# EAGLE design power_supply_module (EAGLE 6.5.0)
AUTHOR: N. Jackson; REV: A; TITLE: Power Supply Module

## Sheet 1 of 9
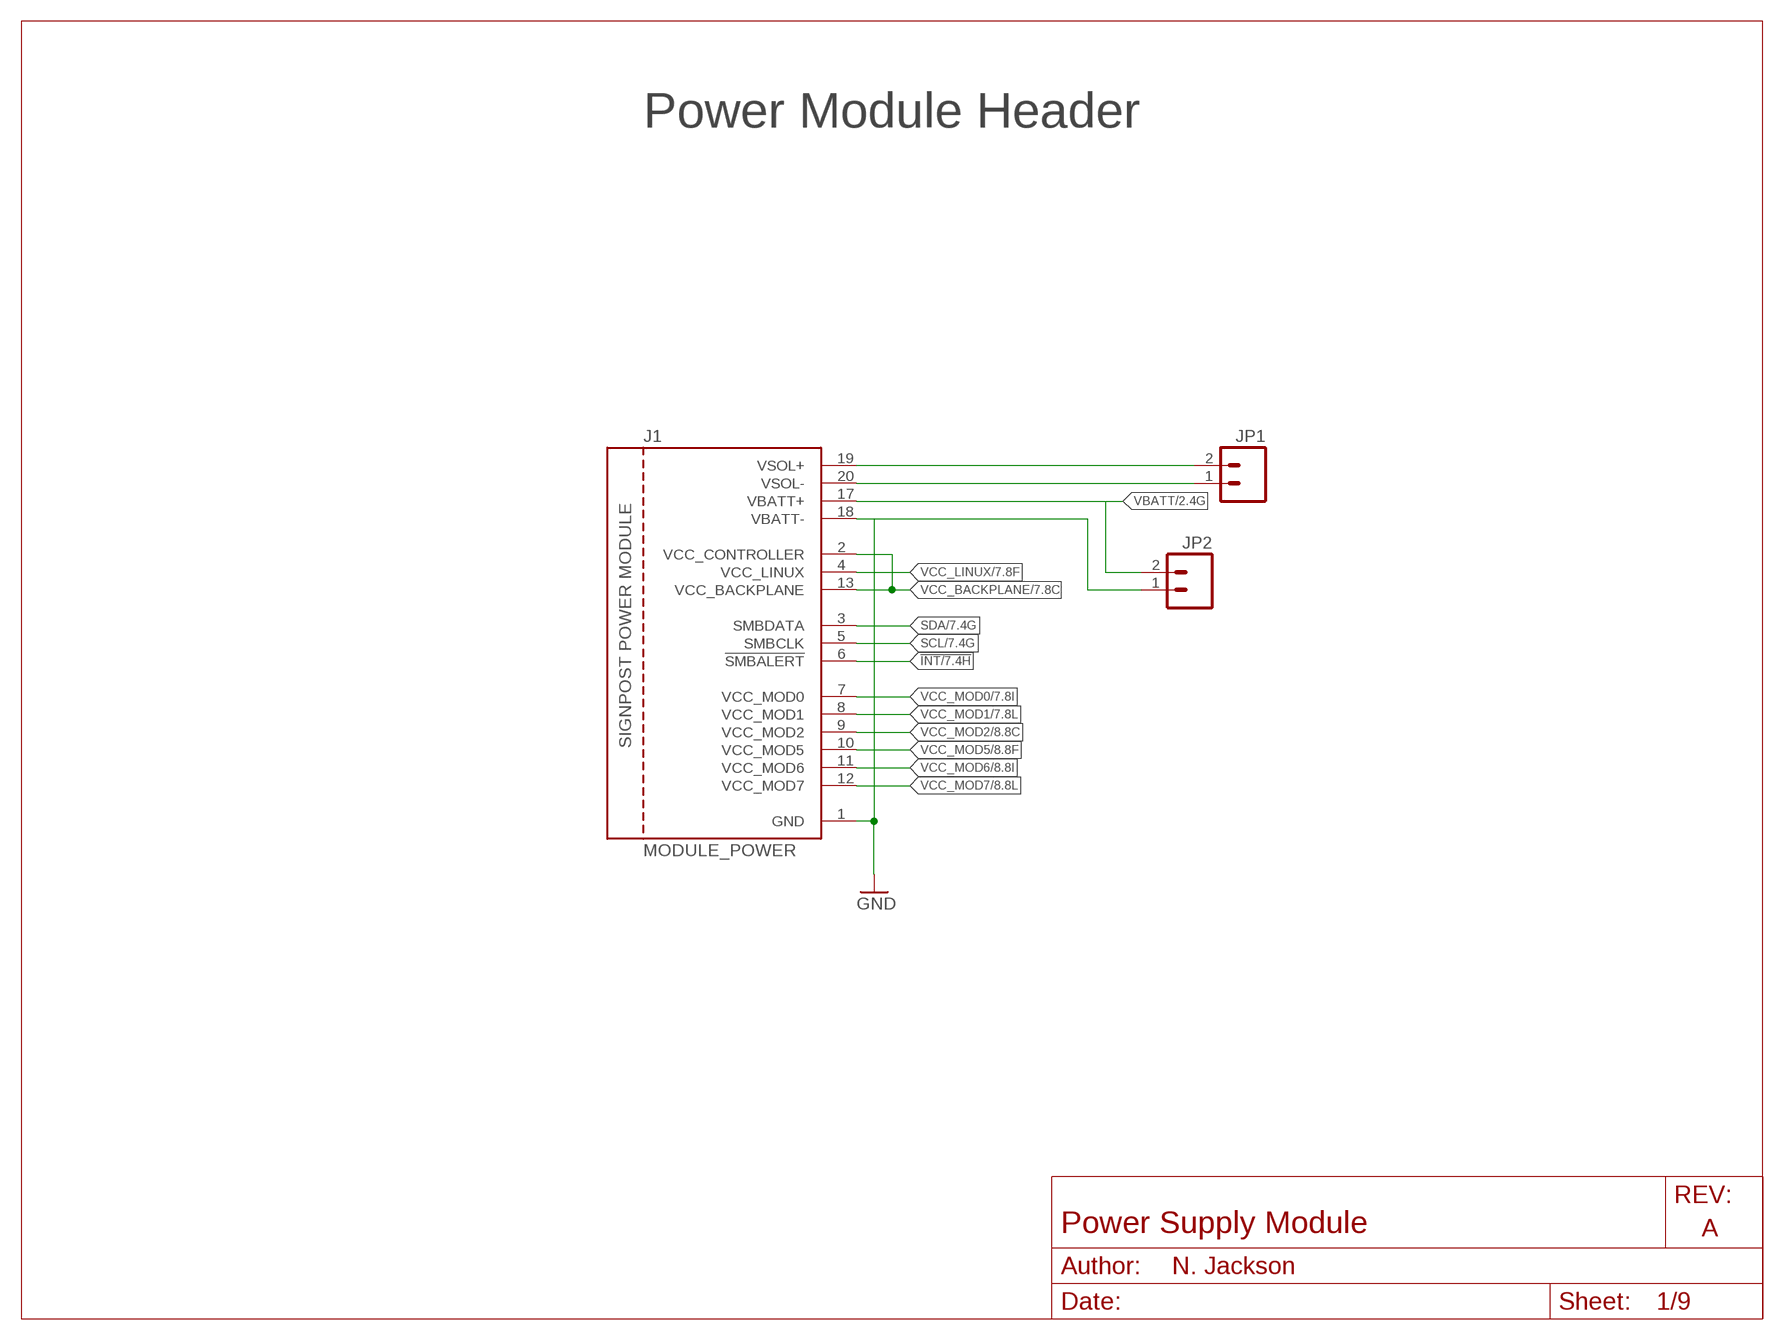
[diagram p0: schematic, sheet 1]

### Parts
J1  MODULE_POWER  [MODULE_POWER]
JP1  M02PTH  [1X02]
JP2  M02PTH  [1X02]

### Nets
!INT: J1.6(!SMBALERT) ; also sheet 7,8,9
GND: J1.1(GND) J1.18(VBATT-) JP2.1 ; also sheet 2,3,4,5,6,7,8,9
SCL: J1.5(SMBCLK) ; also sheet 7,8,9
SDA: J1.3(SMBDATA) ; also sheet 7,8,9
VBATT: J1.17(VBATT+) JP2.2 ; also sheet 2,3,4,5,6,9
VCC_BACKPLANE: J1.2(VCC_CONTROLLER) J1.13(VCC_BACKPLANE) ; also sheet 7,8,9
VCC_LINUX: J1.4(VCC_LINUX) ; also sheet 7,9
VCC_MOD0: J1.7(VCC_MOD0) ; also sheet 7,9
VCC_MOD1: J1.8(VCC_MOD1) ; also sheet 7,9
VCC_MOD2: J1.9(VCC_MOD2) ; also sheet 8,9
VCC_MOD5: J1.10(VCC_MOD5) ; also sheet 8,9
VCC_MOD6: J1.11(VCC_MOD6) ; also sheet 8,9
VCC_MOD7: J1.12(VCC_MOD7) ; also sheet 8,9
VSOL+: J1.19(VSOL+) JP1.2 ; also sheet 9
VSOL-: J1.20(VSOL-) JP1.1 ; also sheet 9

### Notes on the sheet
- Power Module Header

## Sheet 2 of 9
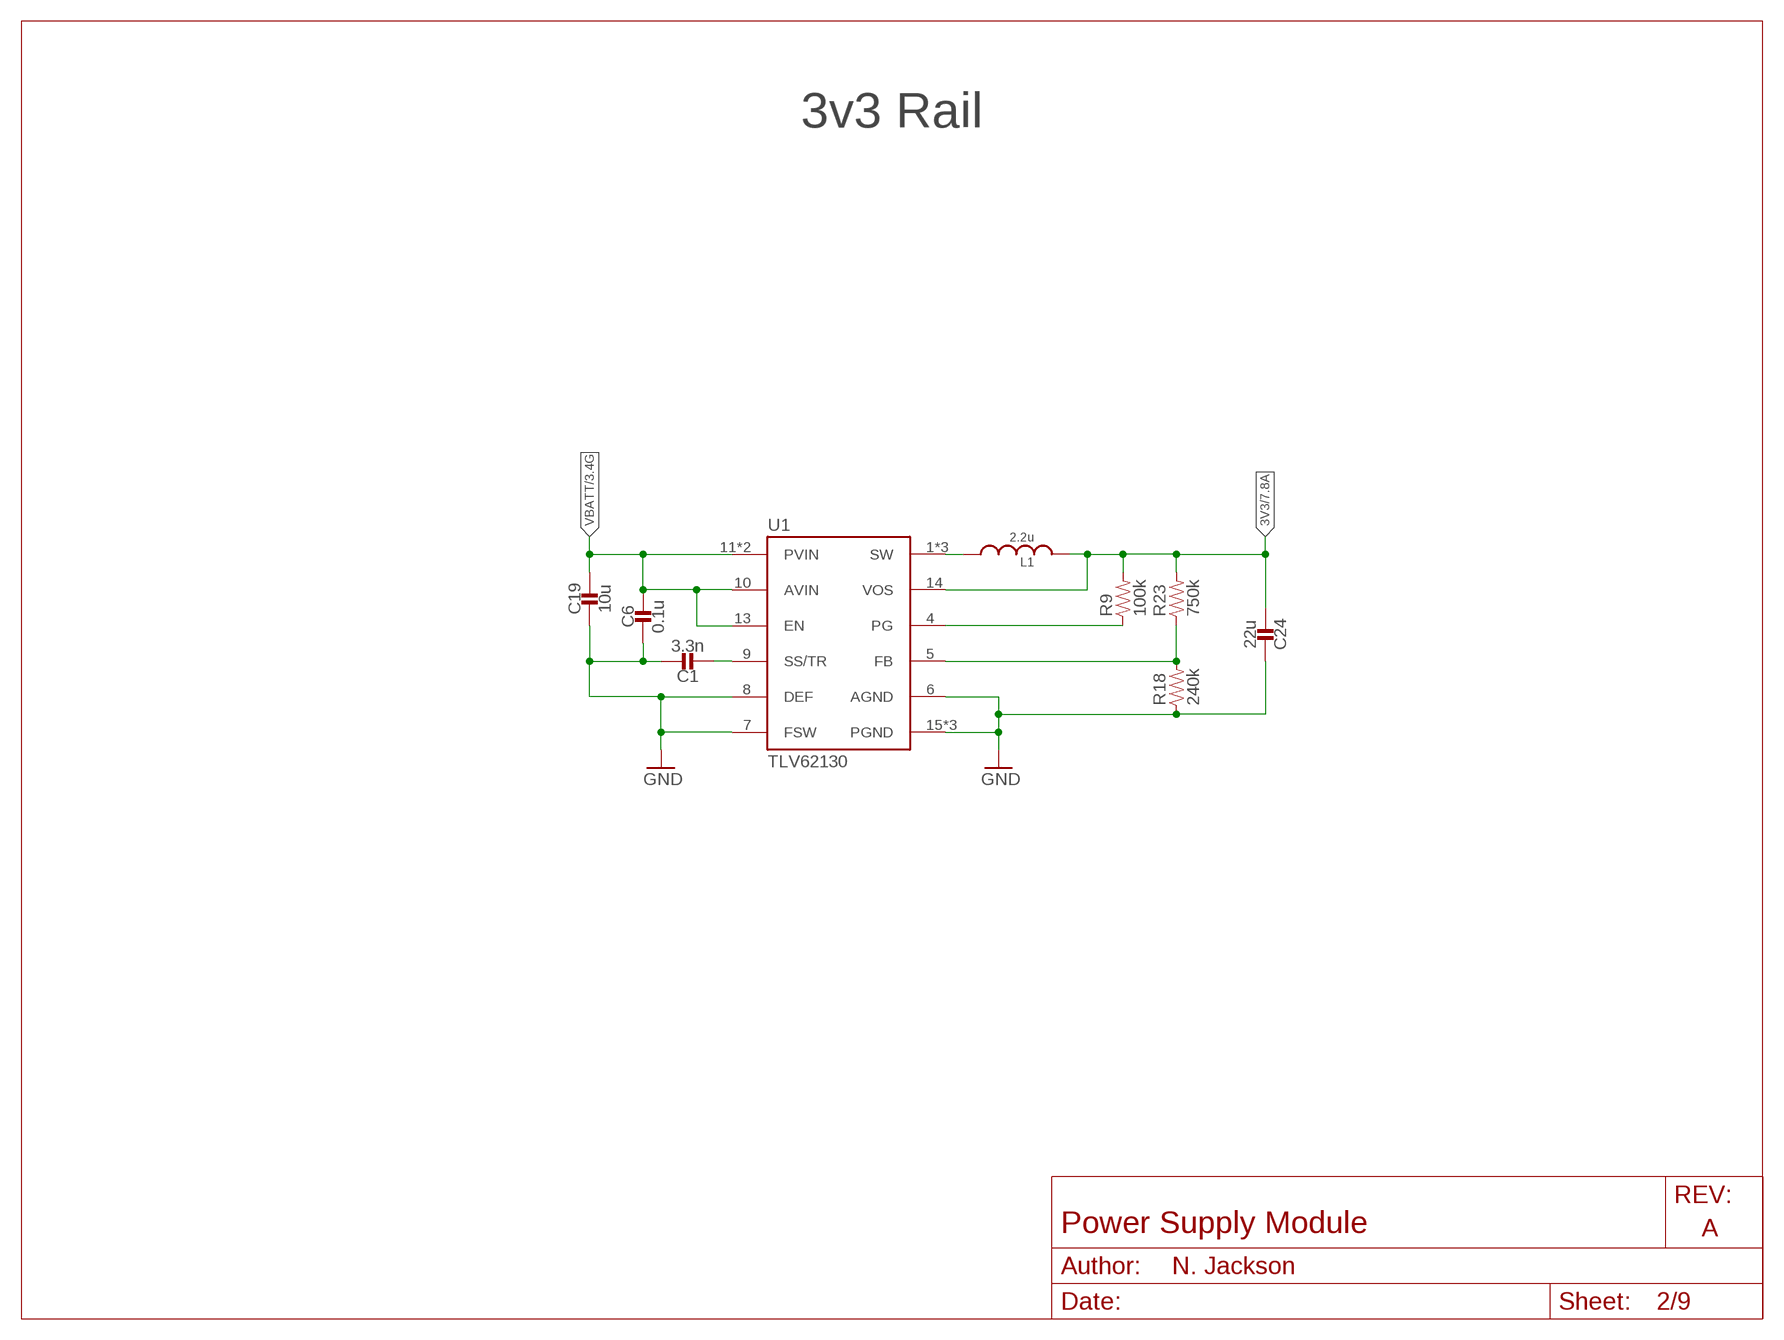
[diagram p1: schematic, sheet 2]

### Parts
C1  3.3n  CAPACITOR0402_CAP  [0402_CAP]
C6  0.1u  CAPACITOR0402_CAP  [0402_CAP]
C19  10u  CAPACITOR0805_CAP  [0805_CAP]
C24  22u  CAPACITOR0603_CAP  [0603_CAP]
L1  2.2u  INDUCTORIHL  [IHL-1212BZ-11]
R9  100k  RESISTOR0402_RES  [0402_RES]
R18  240k  RESISTOR0402_RES  [0402_RES]
R23  750k  RESISTOR0402_RES  [0402_RES]
U1  TLV62130  [TQFN-16/3MM]

### Nets
3V3: C24.2 L1.P$2 R9.2 R23.2 U1.14(VOS) ; also sheet 7,9
GND: C1.1 C6.2 C19.P$2 C24.1 R18.1 U1.6(AGND) U1.7(FSW) U1.8(DEF) U1.15(PGND) U1.16(PGND) U1.GND ; also sheet 1,3,4,5,6,7,8,9
N$61: C1.2 U1.9(SS/TR)
N$62: L1.P$1 U1.1(SW) U1.2(SW) U1.3(SW)
N$63: R9.1 U1.4(PG)
N$64: R18.2 R23.1 U1.5(FB)
VBATT: C6.1 C19.P$1 U1.10(AVIN) U1.11(PVIN) U1.12(PVIN) U1.13(EN) ; also sheet 1,3,4,5,6,9

### Notes on the sheet
- 3v3 Rail

## Sheet 3 of 9
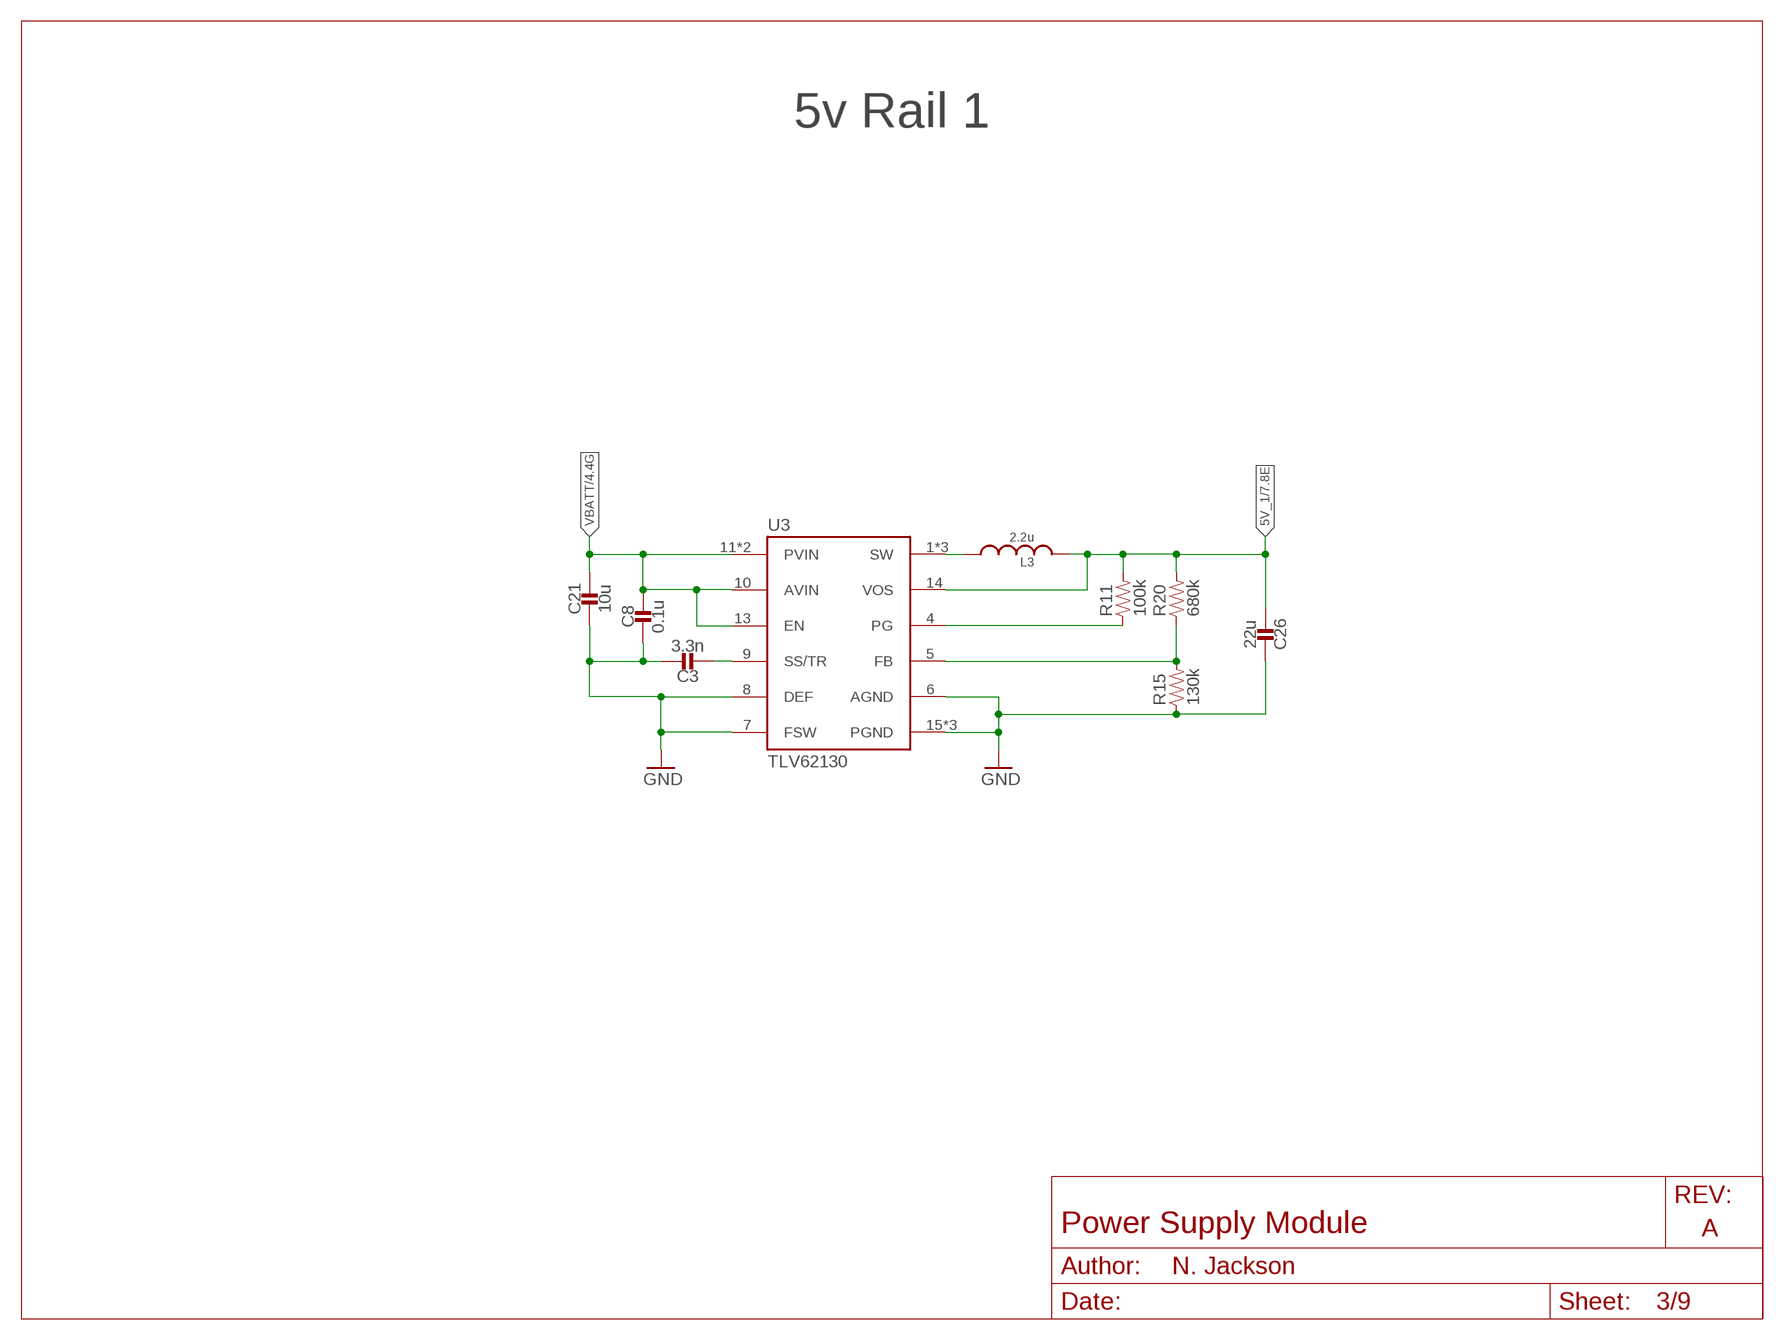
[diagram p2: schematic, sheet 3]

### Parts
C3  3.3n  CAPACITOR0402_CAP  [0402_CAP]
C8  0.1u  CAPACITOR0402_CAP  [0402_CAP]
C21  10u  CAPACITOR0805_CAP  [0805_CAP]
C26  22u  CAPACITOR0603_CAP  [0603_CAP]
L3  2.2u  INDUCTORIHL  [IHL-1212BZ-11]
R11  100k  RESISTOR0402_RES  [0402_RES]
R15  130k  RESISTOR0402_RES  [0402_RES]
R20  680k  RESISTOR0402_RES  [0402_RES]
U3  TLV62130  [TQFN-16/3MM]

### Nets
5V_1: C26.2 L3.P$2 R11.2 R20.2 U3.14(VOS) ; also sheet 7,9
GND: C3.1 C8.2 C21.P$2 C26.1 R15.1 U3.6(AGND) U3.7(FSW) U3.8(DEF) U3.15(PGND) U3.16(PGND) U3.GND ; also sheet 1,2,4,5,6,7,8,9
N$5: C3.2 U3.9(SS/TR)
N$6: L3.P$1 U3.1(SW) U3.2(SW) U3.3(SW)
N$7: R11.1 U3.4(PG)
N$9: R15.2 R20.1 U3.5(FB)
VBATT: C8.1 C21.P$1 U3.10(AVIN) U3.11(PVIN) U3.12(PVIN) U3.13(EN) ; also sheet 1,2,4,5,6,9

### Notes on the sheet
- 5v Rail 1

## Sheet 4 of 9
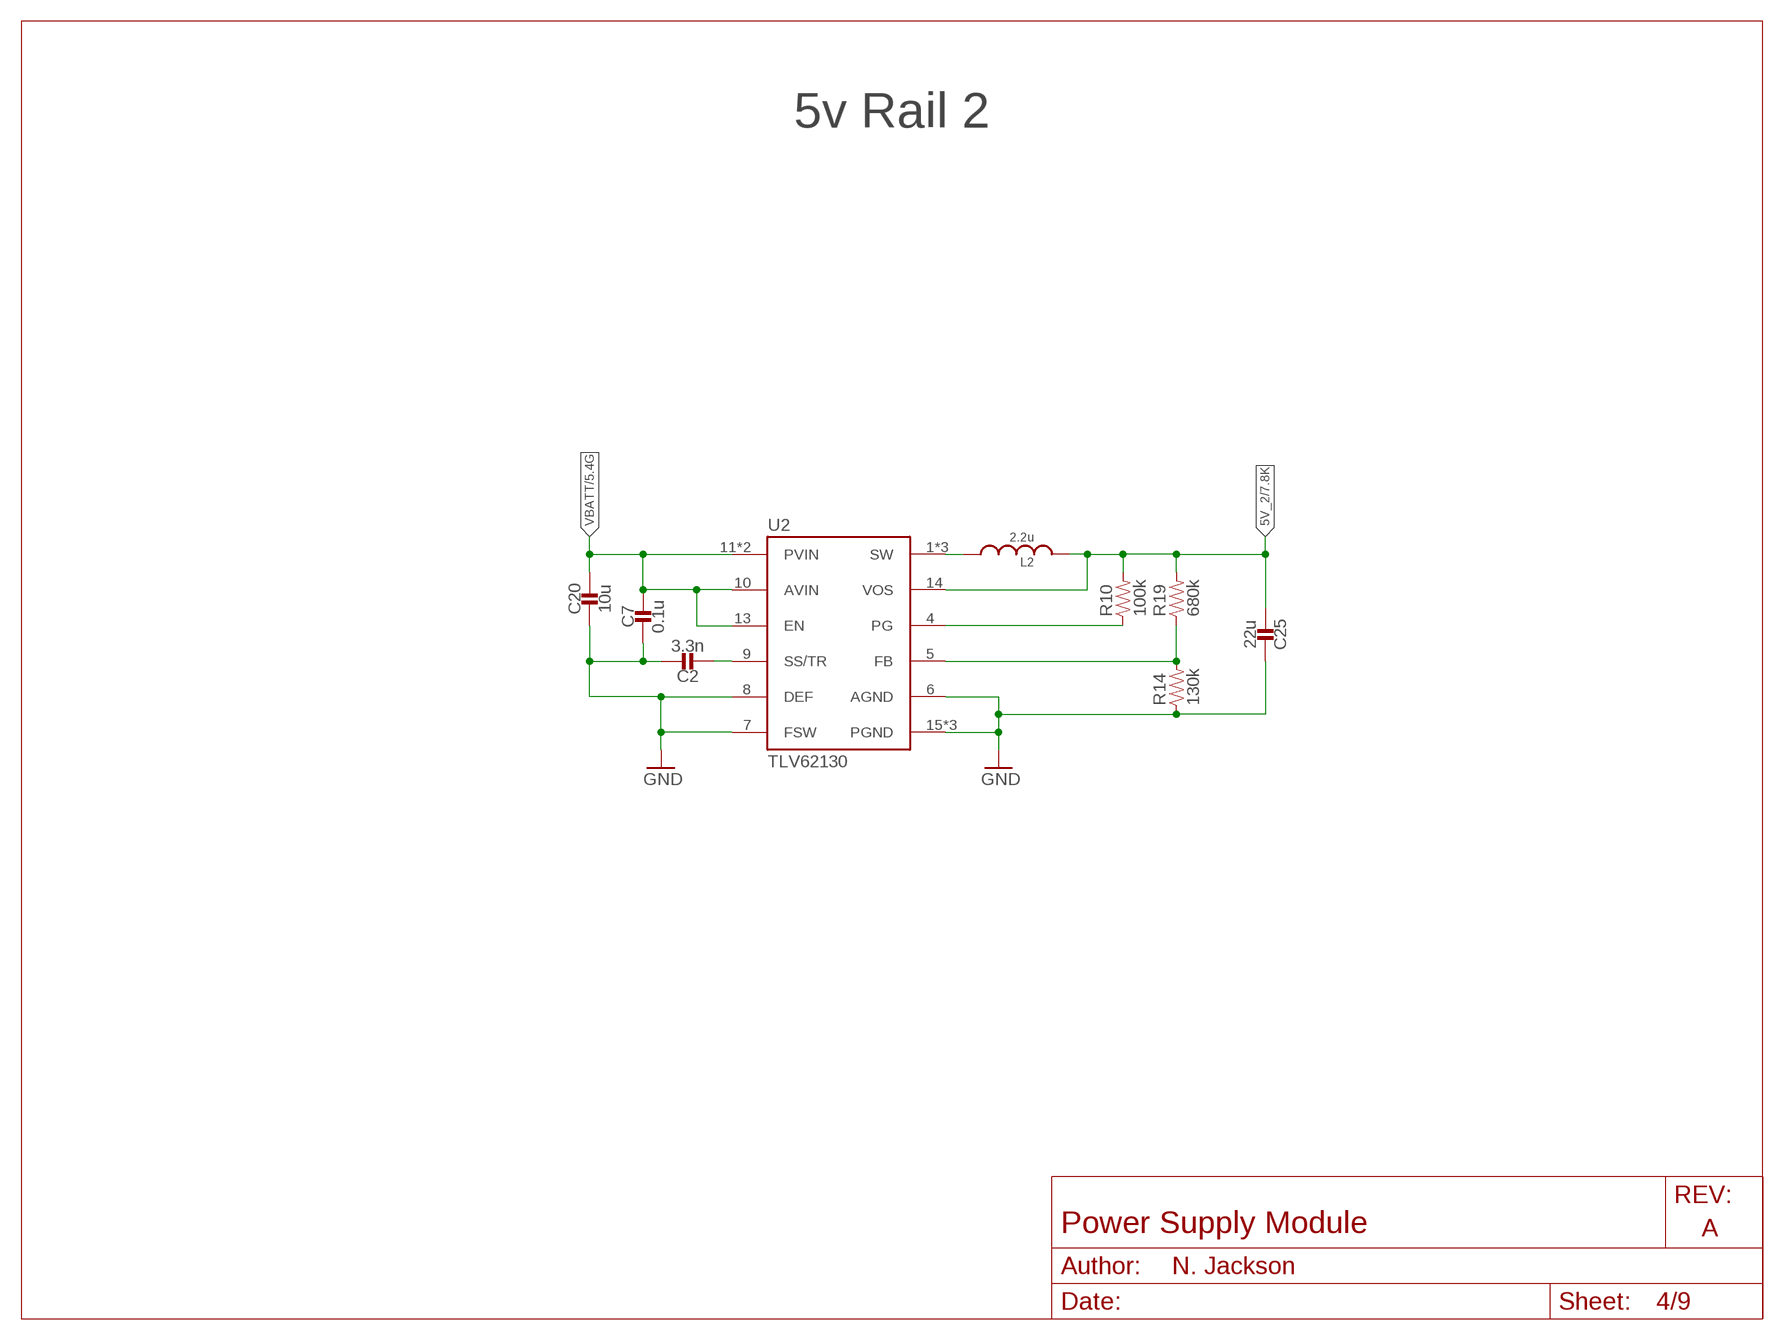
[diagram p3: schematic, sheet 4]

### Parts
C2  3.3n  CAPACITOR0402_CAP  [0402_CAP]
C7  0.1u  CAPACITOR0402_CAP  [0402_CAP]
C20  10u  CAPACITOR0805_CAP  [0805_CAP]
C25  22u  CAPACITOR0603_CAP  [0603_CAP]
L2  2.2u  INDUCTORIHL  [IHL-1212BZ-11]
R10  100k  RESISTOR0402_RES  [0402_RES]
R14  130k  RESISTOR0402_RES  [0402_RES]
R19  680k  RESISTOR0402_RES  [0402_RES]
U2  TLV62130  [TQFN-16/3MM]

### Nets
5V_2: C25.2 L2.P$2 R10.2 R19.2 U2.14(VOS) ; also sheet 7,9
GND: C2.1 C7.2 C20.P$2 C25.1 R14.1 U2.6(AGND) U2.7(FSW) U2.8(DEF) U2.15(PGND) U2.16(PGND) U2.GND ; also sheet 1,2,3,5,6,7,8,9
N$1: C2.2 U2.9(SS/TR)
N$2: L2.P$1 U2.1(SW) U2.2(SW) U2.3(SW)
N$3: R10.1 U2.4(PG)
N$4: R14.2 R19.1 U2.5(FB)
VBATT: C7.1 C20.P$1 U2.10(AVIN) U2.11(PVIN) U2.12(PVIN) U2.13(EN) ; also sheet 1,2,3,5,6,9

### Notes on the sheet
- 5v Rail 2

## Sheet 5 of 9
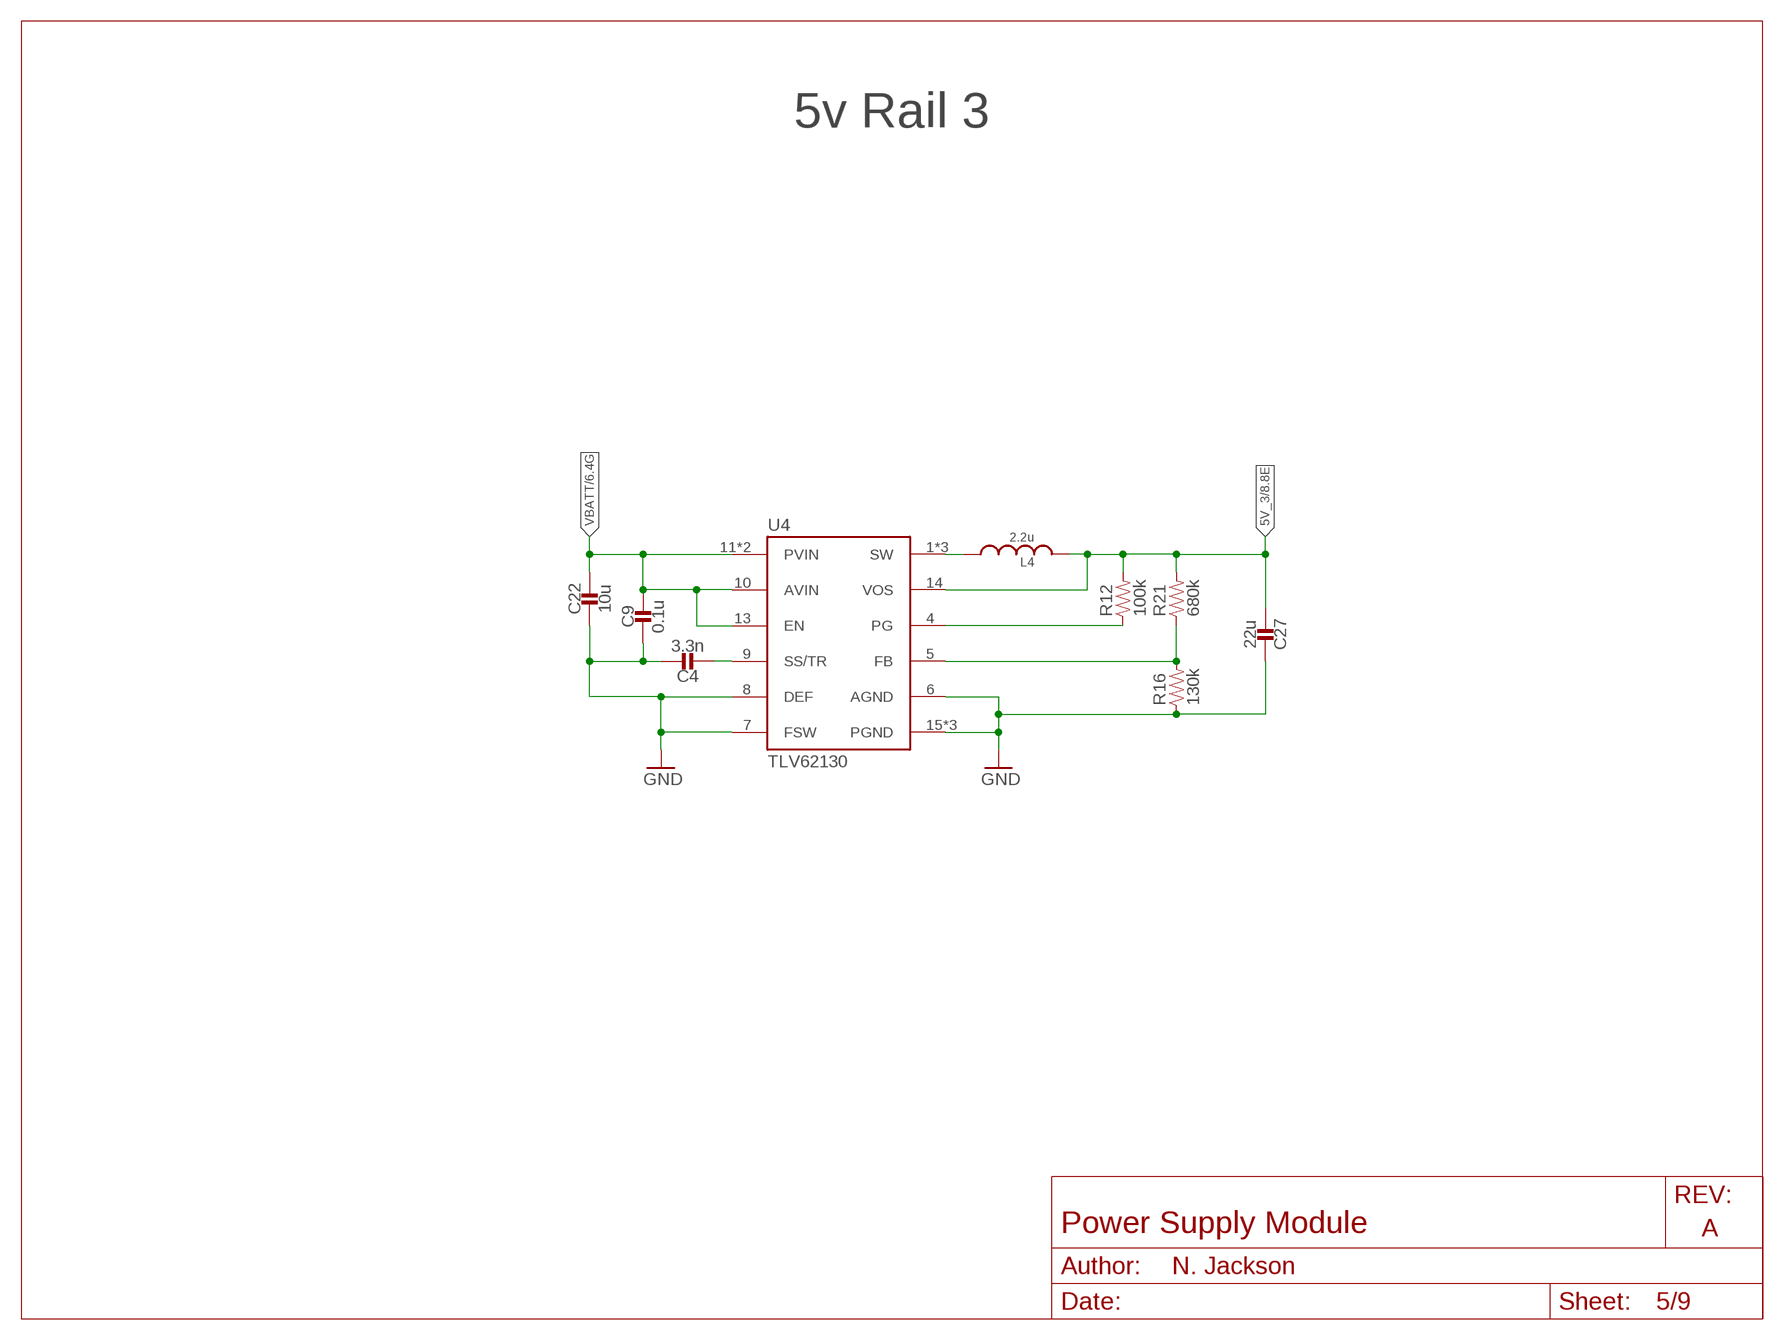
[diagram p4: schematic, sheet 5]

### Parts
C4  3.3n  CAPACITOR0402_CAP  [0402_CAP]
C9  0.1u  CAPACITOR0402_CAP  [0402_CAP]
C22  10u  CAPACITOR0805_CAP  [0805_CAP]
C27  22u  CAPACITOR0603_CAP  [0603_CAP]
L4  2.2u  INDUCTORIHL  [IHL-1212BZ-11]
R12  100k  RESISTOR0402_RES  [0402_RES]
R16  130k  RESISTOR0402_RES  [0402_RES]
R21  680k  RESISTOR0402_RES  [0402_RES]
U4  TLV62130  [TQFN-16/3MM]

### Nets
5V_3: C27.2 L4.P$2 R12.2 R21.2 U4.14(VOS) ; also sheet 8,9
GND: C4.1 C9.2 C22.P$2 C27.1 R16.1 U4.6(AGND) U4.7(FSW) U4.8(DEF) U4.15(PGND) U4.16(PGND) U4.GND ; also sheet 1,2,3,4,6,7,8,9
N$8: C4.2 U4.9(SS/TR)
N$10: L4.P$1 U4.1(SW) U4.2(SW) U4.3(SW)
N$11: R12.1 U4.4(PG)
N$12: R16.2 R21.1 U4.5(FB)
VBATT: C9.1 C22.P$1 U4.10(AVIN) U4.11(PVIN) U4.12(PVIN) U4.13(EN) ; also sheet 1,2,3,4,6,9

### Notes on the sheet
- 5v Rail 3

## Sheet 6 of 9
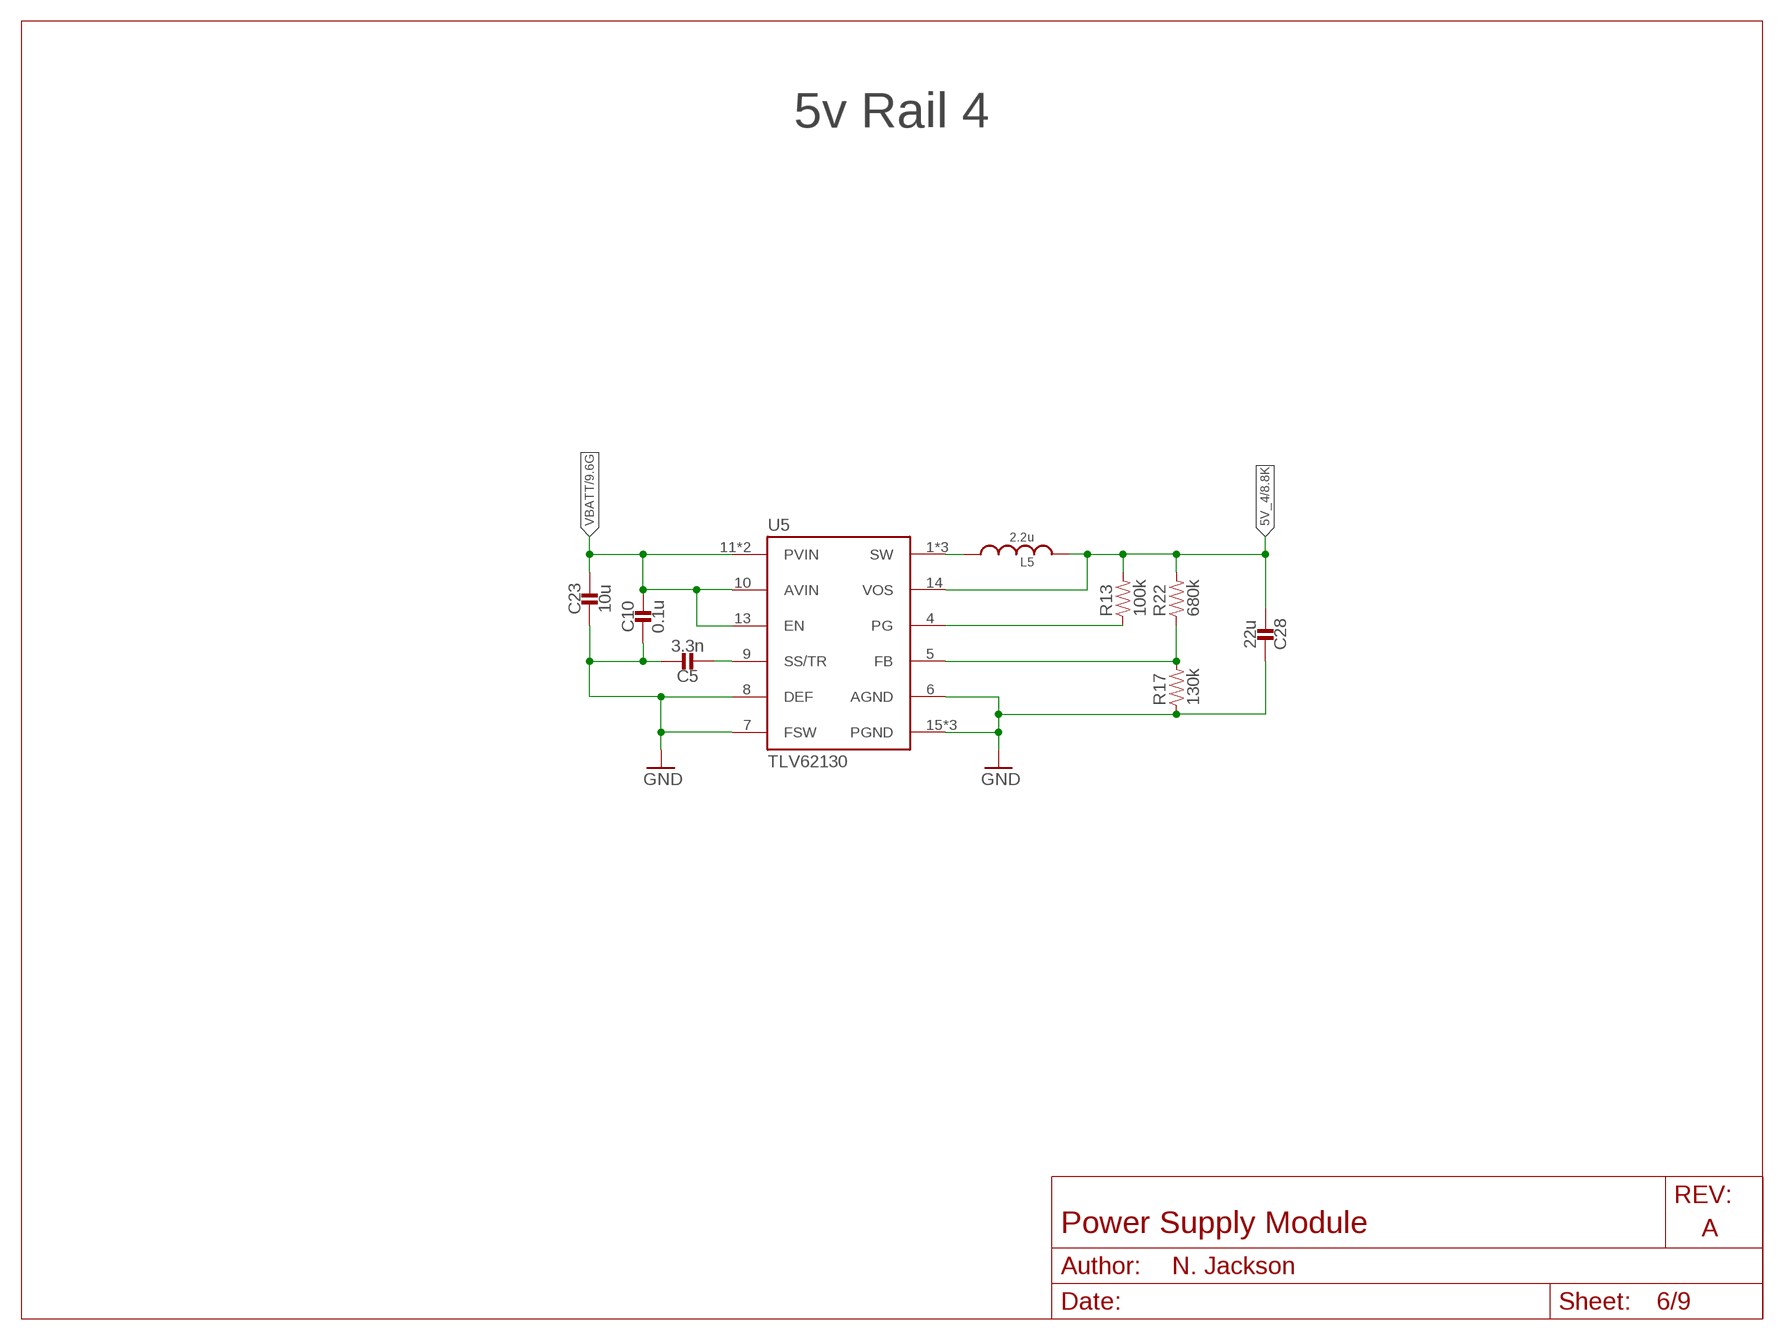
[diagram p5: schematic, sheet 6]

### Parts
C5  3.3n  CAPACITOR0402_CAP  [0402_CAP]
C10  0.1u  CAPACITOR0402_CAP  [0402_CAP]
C23  10u  CAPACITOR0805_CAP  [0805_CAP]
C28  22u  CAPACITOR0603_CAP  [0603_CAP]
L5  2.2u  INDUCTORIHL  [IHL-1212BZ-11]
R13  100k  RESISTOR0402_RES  [0402_RES]
R17  130k  RESISTOR0402_RES  [0402_RES]
R22  680k  RESISTOR0402_RES  [0402_RES]
U5  TLV62130  [TQFN-16/3MM]

### Nets
5V_4: C28.2 L5.P$2 R13.2 R22.2 U5.14(VOS) ; also sheet 8,9
GND: C5.1 C10.2 C23.P$2 C28.1 R17.1 U5.6(AGND) U5.7(FSW) U5.8(DEF) U5.15(PGND) U5.16(PGND) U5.GND ; also sheet 1,2,3,4,5,7,8,9
N$13: C5.2 U5.9(SS/TR)
N$14: L5.P$1 U5.1(SW) U5.2(SW) U5.3(SW)
N$15: R13.1 U5.4(PG)
N$16: R17.2 R22.1 U5.5(FB)
VBATT: C10.1 C23.P$1 U5.10(AVIN) U5.11(PVIN) U5.12(PVIN) U5.13(EN) ; also sheet 1,2,3,4,5,9

### Notes on the sheet
- 5v Rail 4

## Sheet 7 of 9
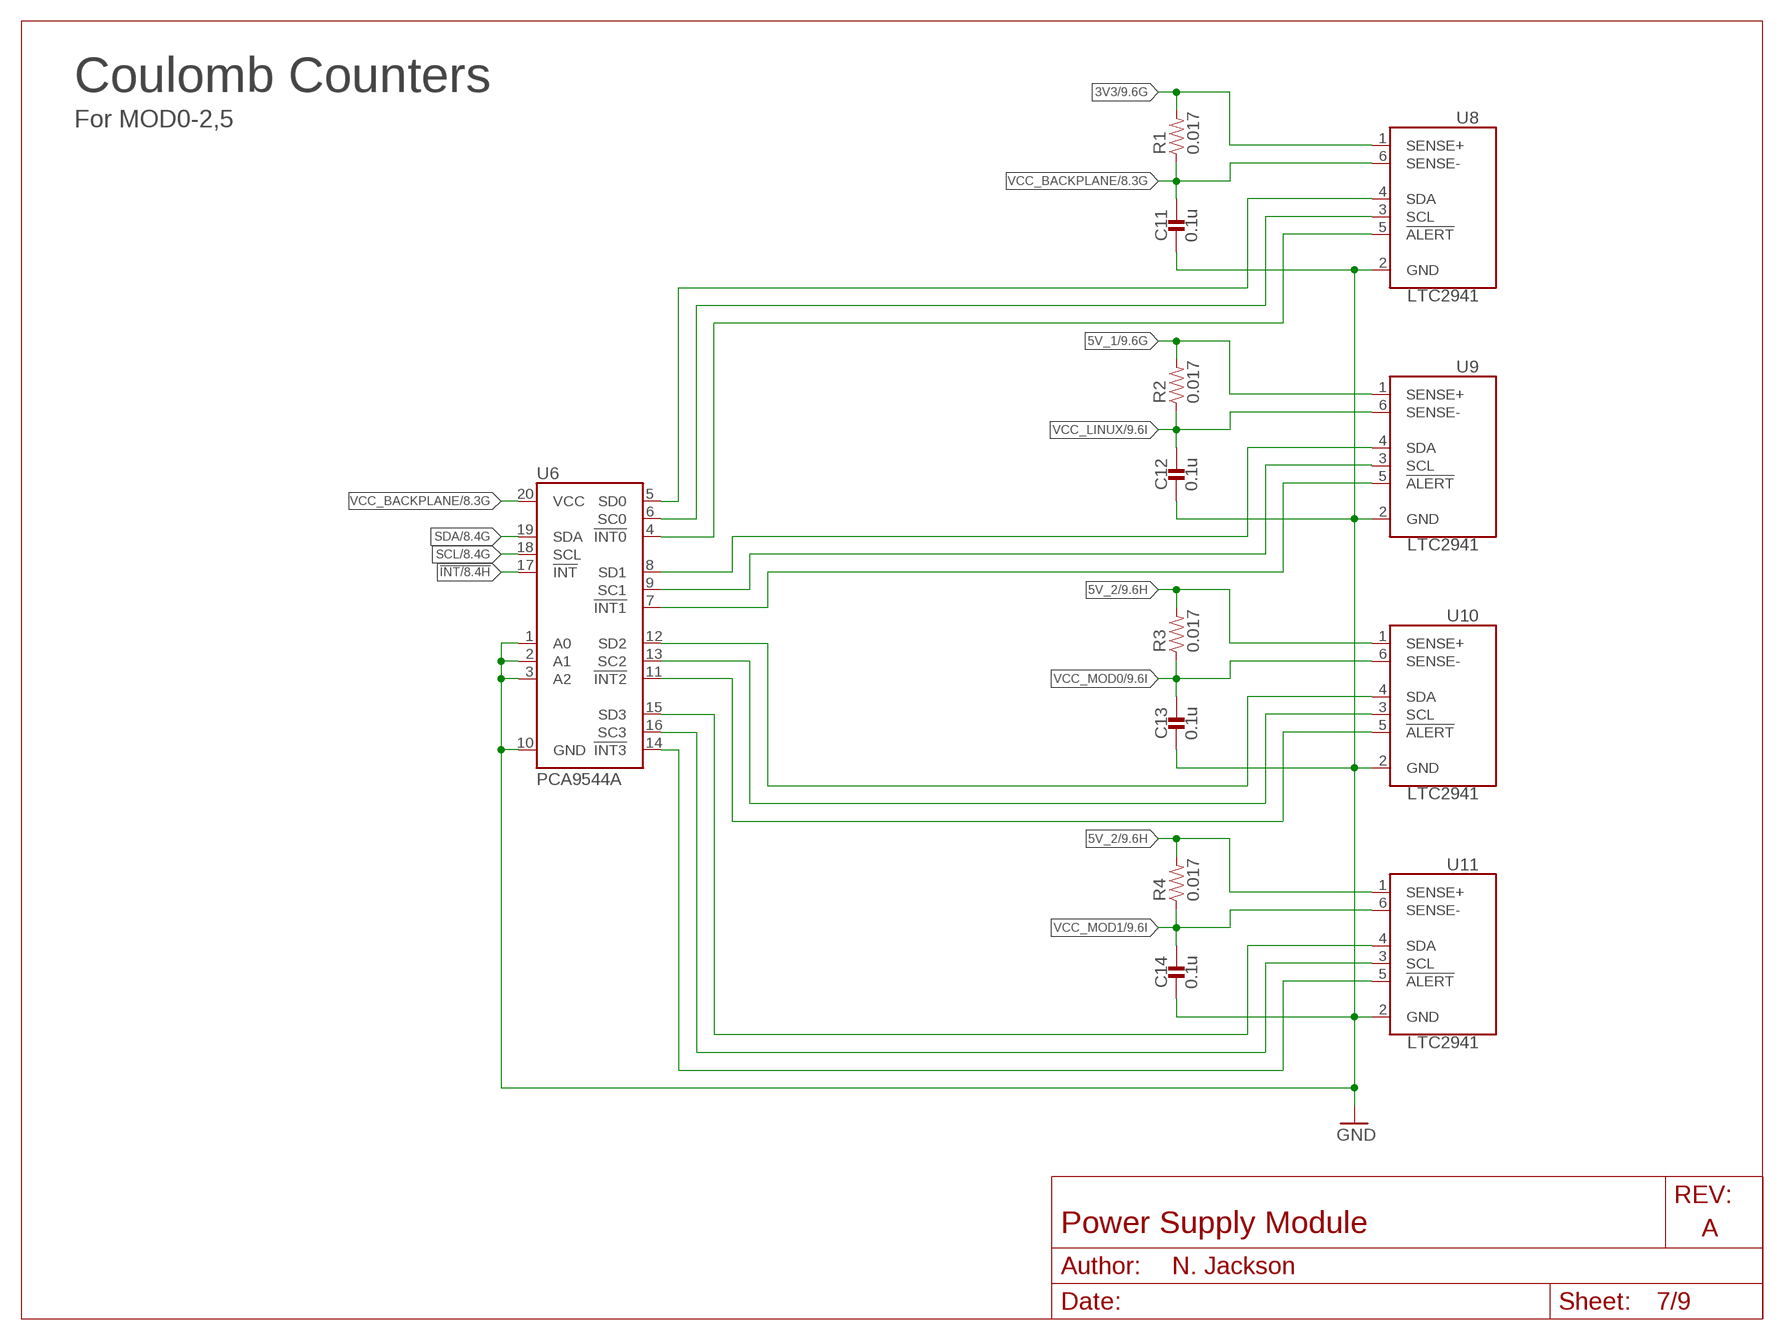
[diagram p6: schematic, sheet 7]

### Parts
C11  0.1u  CAPACITOR0402_CAP  [0402_CAP]
C12  0.1u  CAPACITOR0402_CAP  [0402_CAP]
C13  0.1u  CAPACITOR0402_CAP  [0402_CAP]
C14  0.1u  CAPACITOR0402_CAP  [0402_CAP]
R1  0.017  RESISTOR0805_RES  [0805_RES]
R2  0.017  RESISTOR0805_RES  [0805_RES]
R3  0.017  RESISTOR0805_RES  [0805_RES]
R4  0.017  RESISTOR0805_RES  [0805_RES]
U6  PCA9544A  [SO20L]
U8  LTC2941  [DFN-6-2MMX3MM]
U9  LTC2941  [DFN-6-2MMX3MM]
U10  LTC2941  [DFN-6-2MMX3MM]
U11  LTC2941  [DFN-6-2MMX3MM]

### Nets
3V3: R1.2 U8.1(SENSE+) ; also sheet 2,9
5V_1: R2.2 U9.1(SENSE+) ; also sheet 3,9
5V_2: R3.2 R4.2 U10.1(SENSE+) U11.1(SENSE+) ; also sheet 4,9
!INT: U6.17(!INT) ; also sheet 1,8,9
GND: C11.2 C12.2 C13.2 C14.2 U6.1(A0) U6.2(A1) U6.3(A2) U6.10(GND) U8.2(GND) U9.2(GND) U10.2(GND) U11.2(GND) ; also sheet 1,2,3,4,5,6,8,9
N$43: U6.5(SD0) U8.4(SDA)
N$47: U6.6(SC0) U8.3(SCL)
N$52: U6.12(SD2) U10.4(SDA)
N$53: U6.13(SC2) U10.3(SCL)
N$54: U6.11(!INT2) U10.5(!ALERT)
N$55: U6.15(SD3) U11.4(SDA)
N$56: U6.16(SC3) U11.3(SCL)
N$57: U6.14(!INT3) U11.5(!ALERT)
N$67: U6.4(!INT0) U8.5(!ALERT)
N$68: U6.8(SD1) U9.4(SDA)
N$70: U6.9(SC1) U9.3(SCL)
N$71: U6.7(!INT1) U9.5(!ALERT)
SCL: U6.18(SCL) ; also sheet 1,8,9
SDA: U6.19(SDA) ; also sheet 1,8,9
VCC_BACKPLANE: C11.1 R1.1 U6.20(VCC) U8.6(SENSE-) ; also sheet 1,8,9
VCC_LINUX: C12.1 R2.1 U9.6(SENSE-) ; also sheet 1,9
VCC_MOD0: C13.1 R3.1 U10.6(SENSE-) ; also sheet 1,9
VCC_MOD1: C14.1 R4.1 U11.6(SENSE-) ; also sheet 1,9

### Notes on the sheet
- Coulomb Counters
- For MOD0-2,5

## Sheet 8 of 9
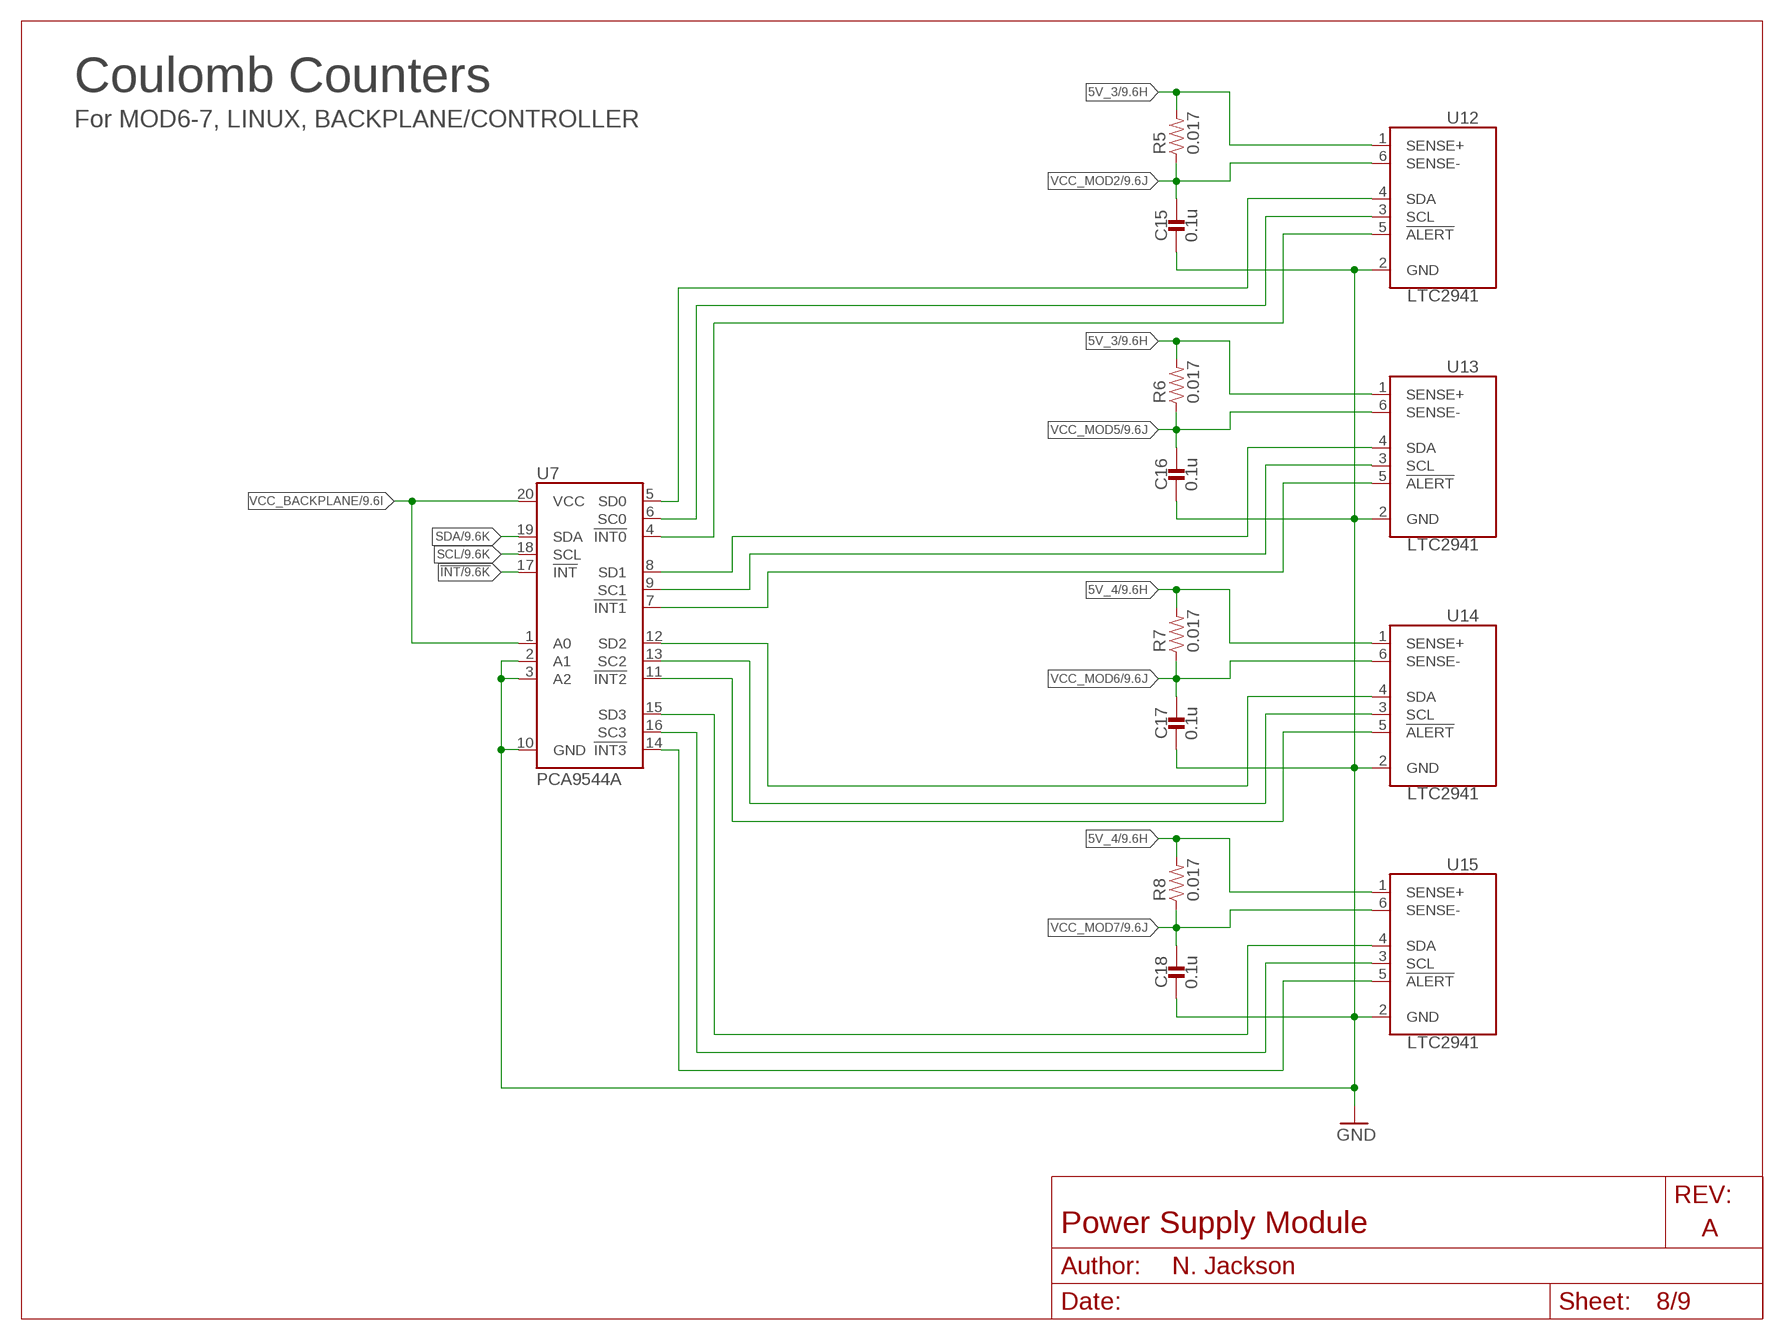
[diagram p7: schematic, sheet 8]

### Parts
C15  0.1u  CAPACITOR0402_CAP  [0402_CAP]
C16  0.1u  CAPACITOR0402_CAP  [0402_CAP]
C17  0.1u  CAPACITOR0402_CAP  [0402_CAP]
C18  0.1u  CAPACITOR0402_CAP  [0402_CAP]
R5  0.017  RESISTOR0805_RES  [0805_RES]
R6  0.017  RESISTOR0805_RES  [0805_RES]
R7  0.017  RESISTOR0805_RES  [0805_RES]
R8  0.017  RESISTOR0805_RES  [0805_RES]
U7  PCA9544A  [SO20L]
U12  LTC2941  [DFN-6-2MMX3MM]
U13  LTC2941  [DFN-6-2MMX3MM]
U14  LTC2941  [DFN-6-2MMX3MM]
U15  LTC2941  [DFN-6-2MMX3MM]

### Nets
5V_3: R5.2 R6.2 U12.1(SENSE+) U13.1(SENSE+) ; also sheet 5,9
5V_4: R7.2 R8.2 U14.1(SENSE+) U15.1(SENSE+) ; also sheet 6,9
!INT: U7.17(!INT) ; also sheet 1,7,9
GND: C15.2 C16.2 C17.2 C18.2 U7.2(A1) U7.3(A2) U7.10(GND) U12.2(GND) U13.2(GND) U14.2(GND) U15.2(GND) ; also sheet 1,2,3,4,5,6,7,9
N$21: U7.5(SD0) U12.4(SDA)
N$22: U7.6(SC0) U12.3(SCL)
N$23: U7.12(SD2) U14.4(SDA)
N$24: U7.13(SC2) U14.3(SCL)
N$25: U7.11(!INT2) U14.5(!ALERT)
N$26: U7.15(SD3) U15.4(SDA)
N$27: U7.16(SC3) U15.3(SCL)
N$46: U7.14(!INT3) U15.5(!ALERT)
N$48: U7.4(!INT0) U12.5(!ALERT)
N$49: U7.8(SD1) U13.4(SDA)
N$50: U7.9(SC1) U13.3(SCL)
N$51: U7.7(!INT1) U13.5(!ALERT)
SCL: U7.18(SCL) ; also sheet 1,7,9
SDA: U7.19(SDA) ; also sheet 1,7,9
VCC_BACKPLANE: U7.1(A0) U7.20(VCC) ; also sheet 1,7,9
VCC_MOD2: C15.1 R5.1 U12.6(SENSE-) ; also sheet 1,9
VCC_MOD5: C16.1 R6.1 U13.6(SENSE-) ; also sheet 1,9
VCC_MOD6: C17.1 R7.1 U14.6(SENSE-) ; also sheet 1,9
VCC_MOD7: C18.1 R8.1 U15.6(SENSE-) ; also sheet 1,9

### Notes on the sheet
- Coulomb Counters
- For MOD6-7, LINUX, BACKPLANE/CONTROLLER

## Sheet 9 of 9
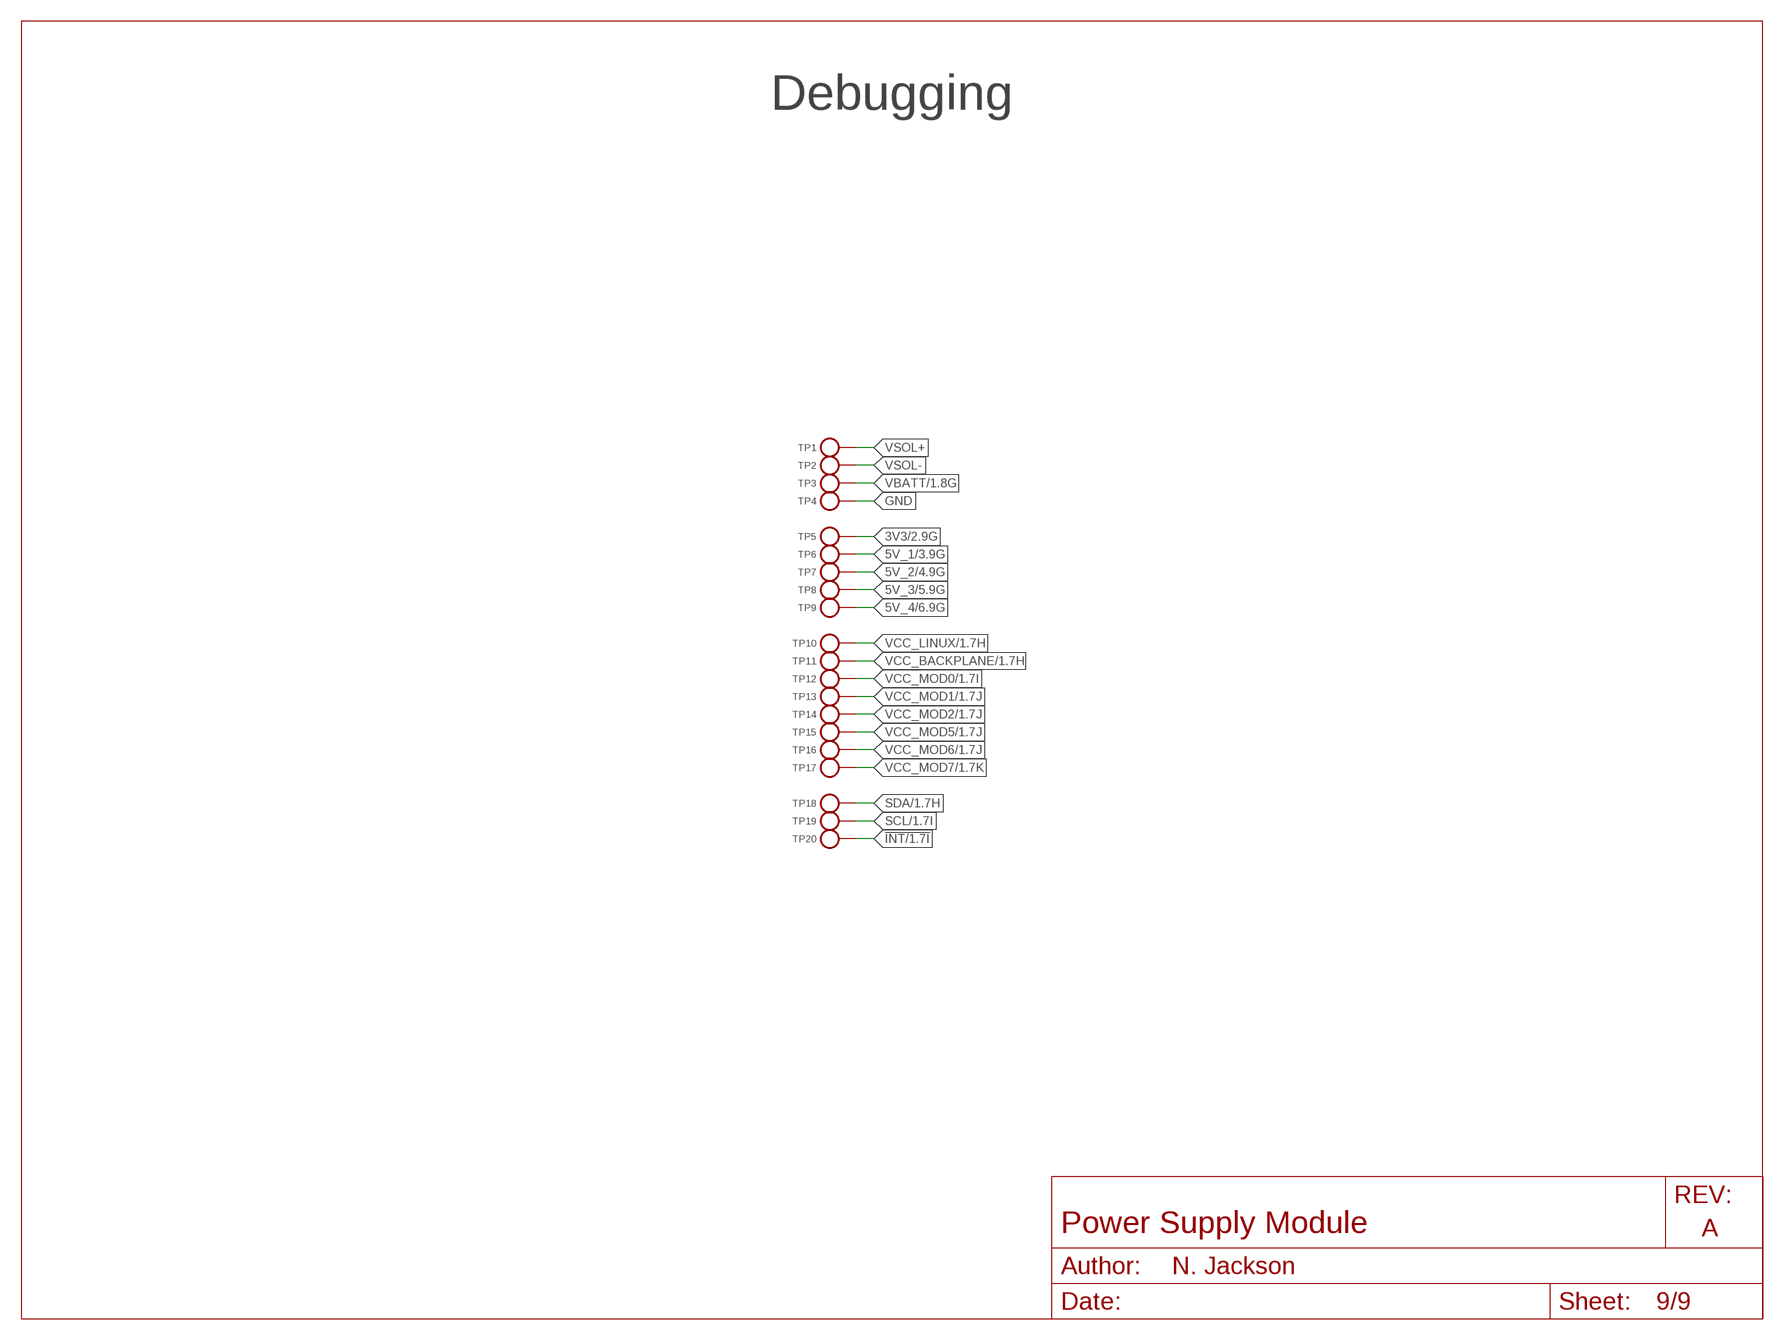
[diagram p8: schematic, sheet 9]

### Parts
TP1  TEST_POINT_0.040IN  [TESTPOINT_0.040IN]
TP2  TEST_POINT_0.040IN  [TESTPOINT_0.040IN]
TP3  TEST_POINT_0.040IN  [TESTPOINT_0.040IN]
TP4  TEST_POINT_0.040IN  [TESTPOINT_0.040IN]
TP5  TEST_POINT_0.040IN  [TESTPOINT_0.040IN]
TP6  TEST_POINT_0.040IN  [TESTPOINT_0.040IN]
TP7  TEST_POINT_0.040IN  [TESTPOINT_0.040IN]
TP8  TEST_POINT_0.040IN  [TESTPOINT_0.040IN]
TP9  TEST_POINT_0.040IN  [TESTPOINT_0.040IN]
TP10  TEST_POINT_0.040IN  [TESTPOINT_0.040IN]
TP11  TEST_POINT_0.040IN  [TESTPOINT_0.040IN]
TP12  TEST_POINT_0.040IN  [TESTPOINT_0.040IN]
TP13  TEST_POINT_0.040IN  [TESTPOINT_0.040IN]
TP14  TEST_POINT_0.040IN  [TESTPOINT_0.040IN]
TP15  TEST_POINT_0.040IN  [TESTPOINT_0.040IN]
TP16  TEST_POINT_0.040IN  [TESTPOINT_0.040IN]
TP17  TEST_POINT_0.040IN  [TESTPOINT_0.040IN]
TP18  TEST_POINT_0.040IN  [TESTPOINT_0.040IN]
TP19  TEST_POINT_0.040IN  [TESTPOINT_0.040IN]
TP20  TEST_POINT_0.040IN  [TESTPOINT_0.040IN]

### Nets
3V3: TP5.TESTPOINT ; also sheet 2,7
5V_1: TP6.TESTPOINT ; also sheet 3,7
5V_2: TP7.TESTPOINT ; also sheet 4,7
5V_3: TP8.TESTPOINT ; also sheet 5,8
5V_4: TP9.TESTPOINT ; also sheet 6,8
!INT: TP20.TESTPOINT ; also sheet 1,7,8
GND: TP4.TESTPOINT ; also sheet 1,2,3,4,5,6,7,8
SCL: TP19.TESTPOINT ; also sheet 1,7,8
SDA: TP18.TESTPOINT ; also sheet 1,7,8
VBATT: TP3.TESTPOINT ; also sheet 1,2,3,4,5,6
VCC_BACKPLANE: TP11.TESTPOINT ; also sheet 1,7,8
VCC_LINUX: TP10.TESTPOINT ; also sheet 1,7
VCC_MOD0: TP12.TESTPOINT ; also sheet 1,7
VCC_MOD1: TP13.TESTPOINT ; also sheet 1,7
VCC_MOD2: TP14.TESTPOINT ; also sheet 1,8
VCC_MOD5: TP15.TESTPOINT ; also sheet 1,8
VCC_MOD6: TP16.TESTPOINT ; also sheet 1,8
VCC_MOD7: TP17.TESTPOINT ; also sheet 1,8
VSOL+: TP1.TESTPOINT ; also sheet 1
VSOL-: TP2.TESTPOINT ; also sheet 1

### Notes on the sheet
- Debugging

## Library data of the parts
C1-C28 = passives:CAPACITOR: 0402 Capacitor
J1 = signpost:MODULE_POWER: Header for power module for signpost; DIGIKEY: S9172-ND
JP1 JP2 = SparkFun-Connectors:M02: Header 2 Standard 2-pin 0.1" header. Use with straight break away headers (SKU : PRT-00116), right angle break away headers (PRT-00553), swiss pins (PRT-00743), machine pins (PRT-00117), and female headers (PRT-00115). Molex polarized connector foot print use with SKU : PRT-08233 with associated crimp pins and housings.
L1-L5 = passives:INDUCTOR: A very specific inductor; DIGIKEY: 541-1322-1-ND
R1-R23 = passives:RESISTOR: Resistor Basic schematic elements and footprints for 0603, 1206, and PTH resistors.
TP1-TP20 = headers:TEST_POINT_0.040IN: 0.040in Test Point; DIGIKEY: 5001K-ND
U1-U5 = chips:TLV62130: High Efficient 3A switching step-down regulator. 1V-5V out, 4V-17V in.; DIGIKEY: 296-35978-1-ND
U6 U7 = signpost:PCA9544A: 1-4 I2C/SMBUS Multiplexer with interrupt for power supply coulomb counters
U8-U15 = signpost:LTC2941: I2C Battery Gas Gauge with External Sense Resistor; DIGIKEY: LTC2941IDCB#TRMPBFCT-ND

## Board
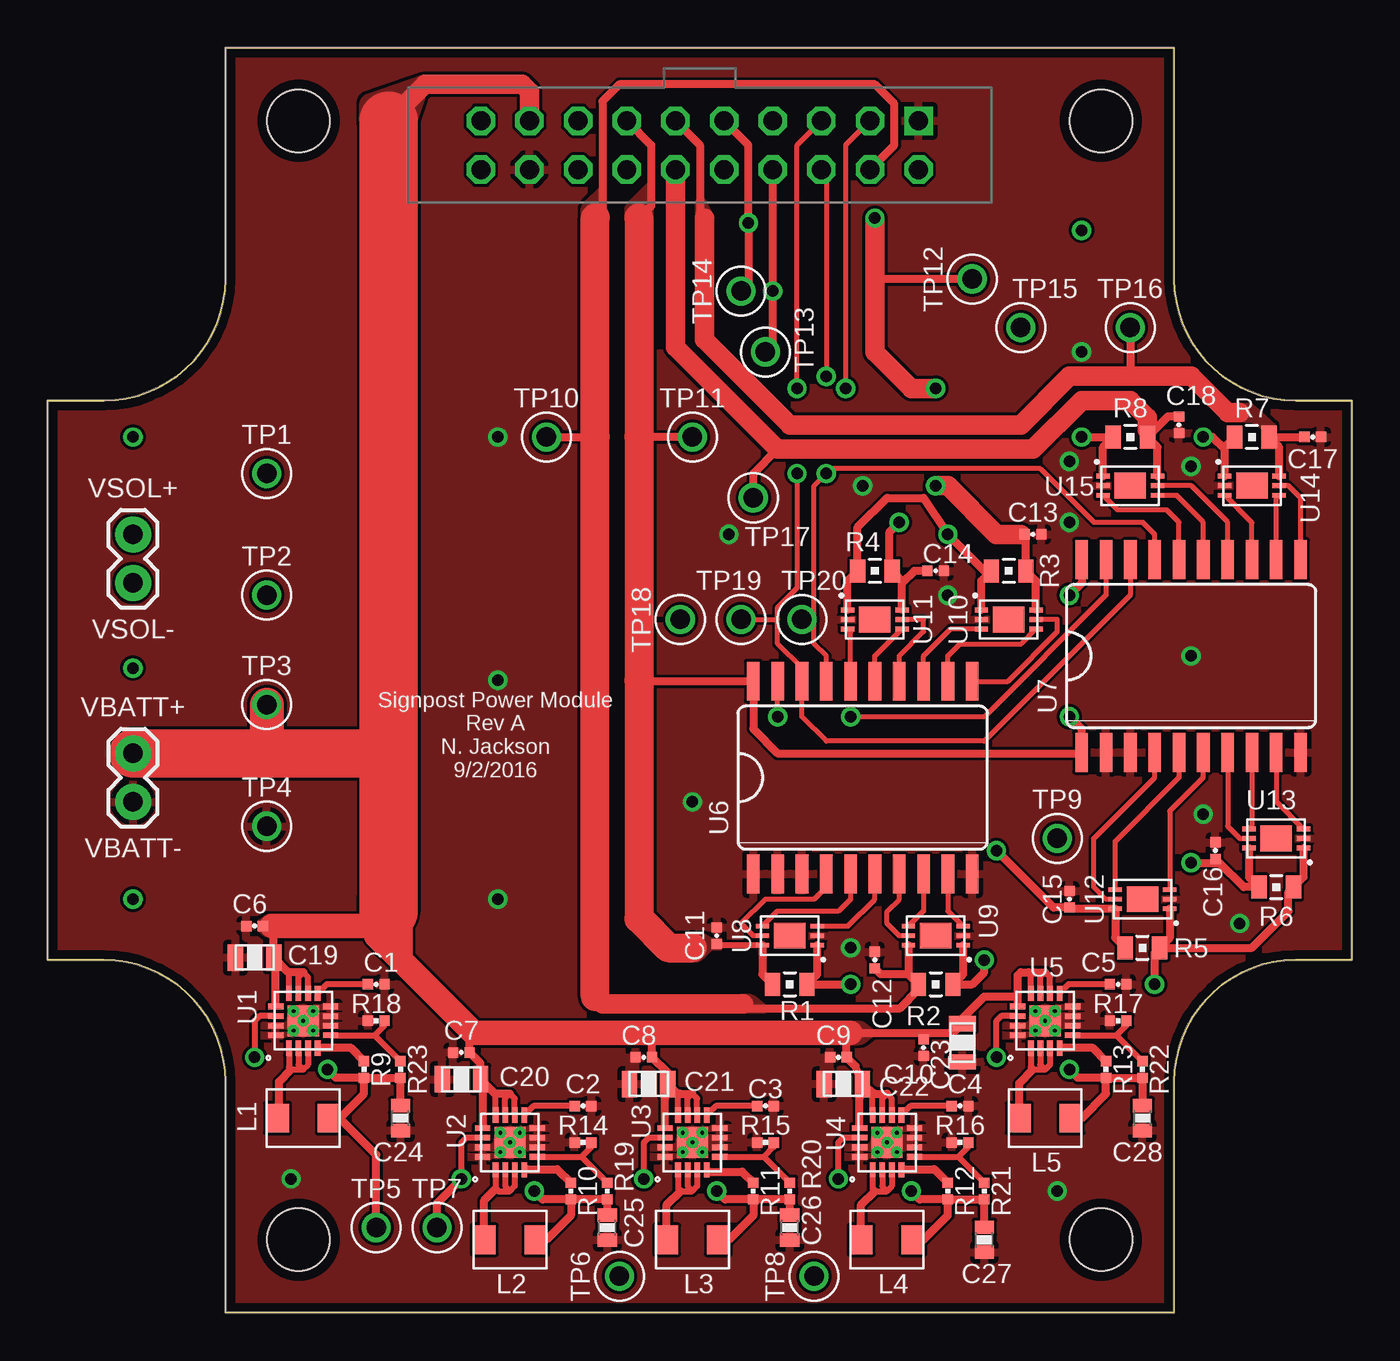
[diagram p9: board, top side]
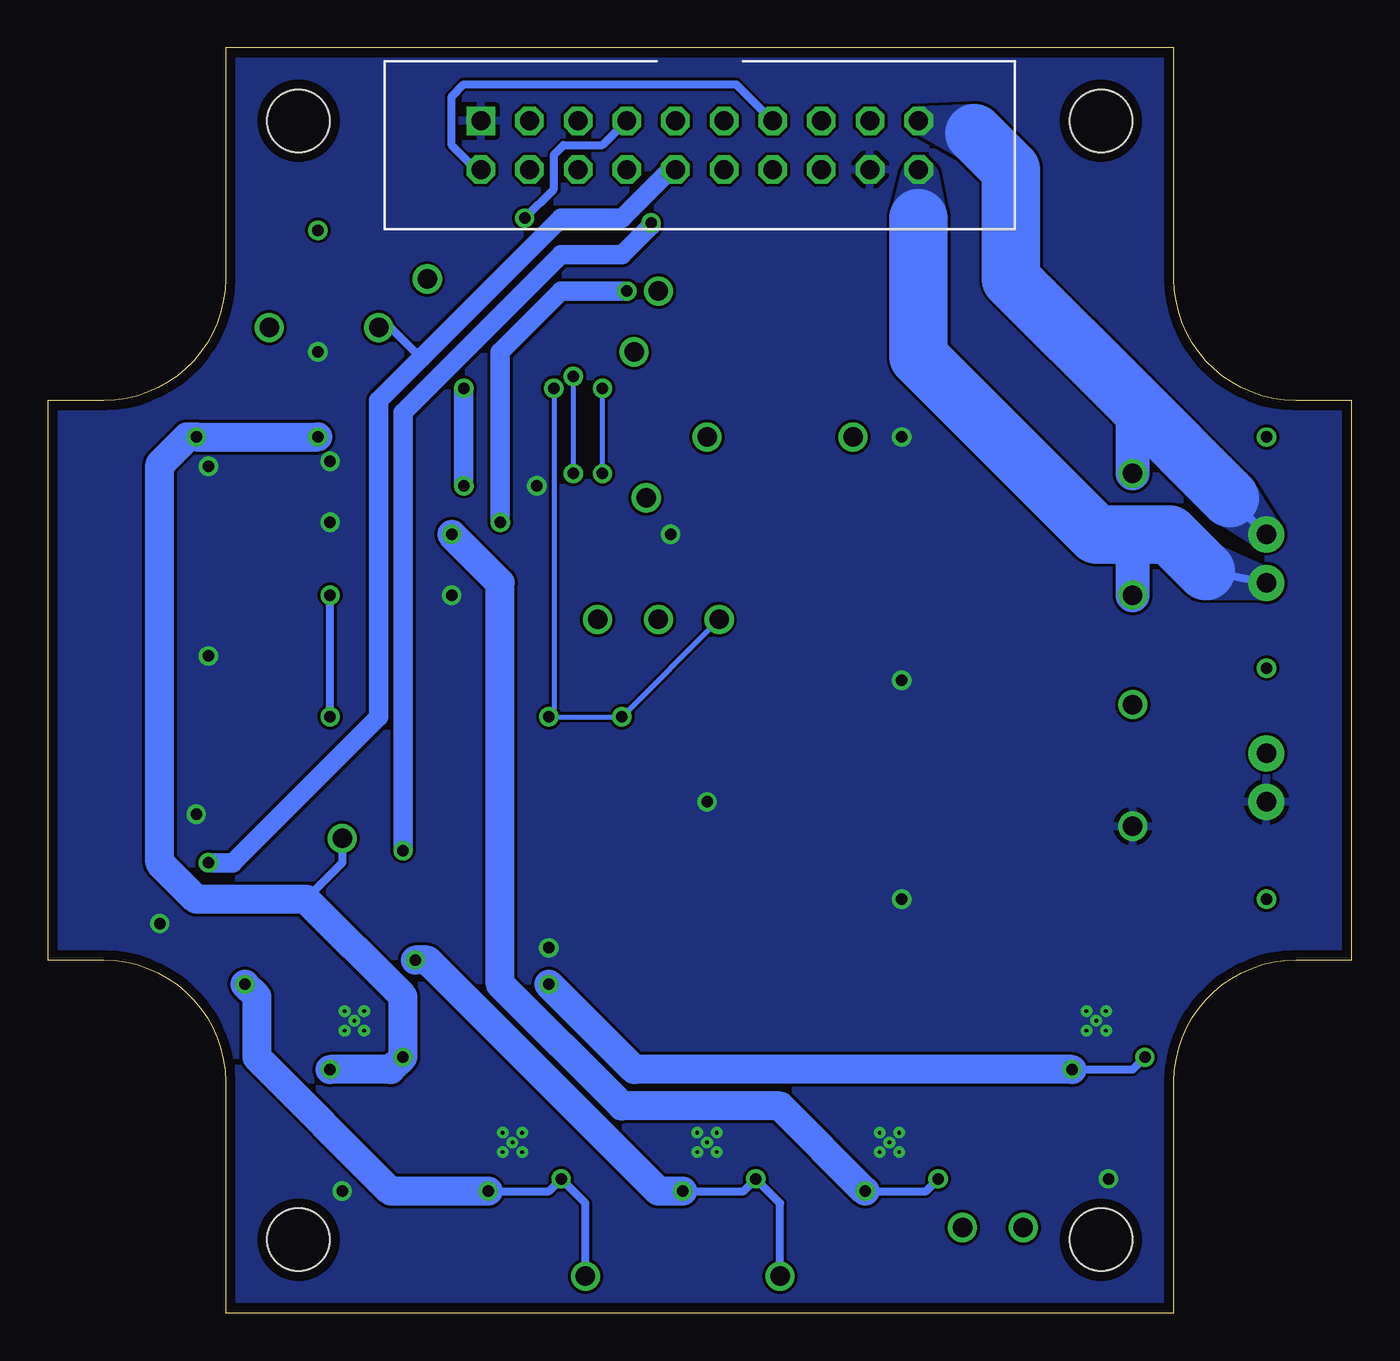
[diagram p10: board, bottom side, seen from below]

Size 68.07 x 66.04 mm. Coordinates in mm from the lower left corner, seen from the top.
Outline: 9.27,0 9.27,12.06 arc90 2.92,18.41 0,18.41 0,47.62 2.92,47.62 arc90 9.27,53.98 9.27,66.04 58.8,66.04 58.8,53.98 arc90 65.15,47.62 68.07,47.62 68.07,18.41 65.15,18.41 arc90 58.8,12.06 58.8,0 9.27,0
Copper layers (1*16): Top 0.0178mm / dielectric 59mil / Bottom 0.0178mm
Design rules "sunstone-2lyr_v1.0.0.3 *": minimum track width 6mil, minimum drill 14mil, track to track 6mil, track to pad 6mil, pad to pad 6mil, via to via 6mil, smd to smd 6mil, copper to edge 20mil, drill to drill 16mil, minimum pad ring 8mil, minimum via ring 8mil, stop-mask expansion 3mil, vias tented up to drill 30mil, thermal gap 10mil
Holes 3.26 mm at 13.08,62.23 54.99,62.23 13.08,3.81 54.99,3.81

### Footprints (pad centres in the part's own frame; a part is rotated, then mirrored left to right if it is on the bottom)
0402_CAP = smd 0.536 x 0.546: 1 -0.433,0; 2 0.433,0
0805_CAP = smd 0.8 x 1.4: P$1 1,0; P$2 -1,0
0603_CAP = smd 0.7 x 1: 1 -0.65,0; 2 0.65,0
MODULE_POWER = drill 0.991 square: 1 11.43,29.21 | drill 0.991 octagon: 2 11.43,26.67; 3 8.89,29.21; 4 8.89,26.67; 5 6.35,29.21; 6 6.35,26.67; 7 3.81,29.21; 8 3.81,26.67; 9 1.27,29.21; 10 1.27,26.67; 11 -1.27,29.21; 12 -1.27,26.67; 13 -3.81,29.21; 14 -3.81,26.67; 15 -6.35,29.21; 16 -6.35,26.67; 17 -8.89,29.21; 18 -8.89,26.67; 19 -11.43,29.21; 20 -11.43,26.67
1X02 = drill 1.016 pad 1.88: 1 0,0; 2 2.54,0
IHL-1212BZ-11 = smd 1.2 x 1.5: P$1 -1.35,0; P$2 1.35,0
0805_RES = smd 0.8 x 1.2: 1 -0.9,0; 2 0.9,0
0402_RES = smd 0.536 x 0.546: 1 -0.433,0; 2 0.433,0
TESTPOINT_0.040IN = drill 1.016: TESTPOINT 0,0
TQFN-16/3MM = smd 0.3 x 0.8: 1 -0.75,-1.43; 2 -0.25,-1.43; 3 0.25,-1.43; 4 0.75,-1.43; 9 0.75,1.43; 10 0.25,1.43; 11 -0.25,1.43; 12 -0.75,1.43 | smd 0.8 x 0.3: 5 1.43,-0.75; 6 1.43,-0.25; 7 1.43,0.25; 8 1.43,0.75; 13 -1.43,0.75; 14 -1.43,0.25; 15 -1.43,-0.25; 16 -1.43,-0.75 | smd 1.63 x 1.63: GND 0,0
SO20L = smd 0.66 x 2.032: 1 -5.715,-5.029; 2 -4.445,-5.029; 3 -3.175,-5.029; 4 -1.905,-5.029; 5 -0.635,-5.029; 6 0.635,-5.029; 7 1.905,-5.029; 8 3.175,-5.029; 9 4.445,-5.029; 10 5.715,-5.029; 11 5.715,5.029; 12 4.445,5.029; 13 3.175,5.029; 14 1.905,5.029; 15 0.635,5.029; 16 -0.635,5.029; 17 -1.905,5.029; 18 -3.175,5.029; 19 -4.445,5.029; 20 -5.715,5.029
DFN-6-2MMX3MM = smd 0.25 x 0.7: 1 -0.5,-1.425; 2 0,-1.425; 3 0.5,-1.425; 4 0.5,1.425; 5 0,1.425; 6 -0.5,1.425 | smd 1.35 x 1.65: NC 0,0

### Placement (x,y rotation side)
C1  17.14,17.14 180 top
C2  27.94,10.79 180 top
C3  37.47,10.79 180 top
C4  47.62,10.79 180 top
C5  55.88,17.14 180 top
C6  10.79,20.19 180 top
C7  21.59,13.59 180 top
C8  31.11,13.34 180 top
C9  41.27,13.34 180 top
C10  45.72,13.84 270 top
C11  34.92,19.68 90 top
C12  43.18,18.41 90 top
C13  51.44,40.64 0 top
C14  46.35,38.73 0 top
C15  53.34,21.59 90 top
C16  60.96,24.13 90 top
C17  66.04,45.72 0 top
C18  59.05,46.35 270 top
C19  10.79,18.54 0 top
C20  21.59,12.19 0 top
C21  31.37,11.94 0 top
C22  41.53,11.94 0 top
C23  47.75,14.1 90 top
C24  18.41,10.16 90 top
C25  29.21,4.45 90 top
C26  38.73,4.45 90 top
C27  48.9,3.81 90 top
C28  57.15,10.16 90 top
J1  34.04,33.02 0 top
JP1  4.45,38.1 90 top
JP2  4.45,26.67 90 top
L1  13.34,10.16 0 top
L2  24.13,3.81 0 top
L3  33.66,3.81 0 top
L4  43.81,3.81 0 top
L5  52.07,10.16 0 top
R1  38.73,17.14 0 top
R2  46.35,17.14 0 top
R3  50.16,38.73 180 top
R4  43.18,38.73 180 top
R5  57.15,19.05 0 top
R6  64.14,22.23 0 top
R7  62.87,45.72 180 top
R8  56.52,45.72 180 top
R9  16.51,12.7 270 top
R10  27.3,6.35 270 top
R11  36.83,6.35 270 top
R12  46.99,6.35 270 top
R13  55.24,12.7 270 top
R14  27.94,8.89 0 top
R15  37.47,8.89 0 top
R16  47.62,8.89 0 top
R17  55.88,15.24 0 top
R18  17.14,15.24 0 top
R19  29.21,6.35 270 top
R20  38.73,6.35 270 top
R21  48.9,6.35 270 top
R22  57.15,12.7 270 top
R23  18.41,12.7 270 top
TP1  11.43,43.81 0 top
TP2  11.43,37.47 0 top
TP3  11.43,31.75 0 top
TP4  11.43,25.4 0 top
TP5  17.14,4.45 0 top
TP6  29.84,1.91 0 top
TP7  20.32,4.45 0 top
TP8  40.01,1.91 0 top
TP9  52.7,24.77 0 top
TP10  26.04,45.72 0 top
TP11  33.66,45.72 0 top
TP12  48.26,53.98 0 top
TP13  37.47,50.16 0 top
TP14  36.2,53.34 0 top
TP15  50.8,51.44 0 top
TP16  56.52,51.44 0 top
TP17  36.83,42.55 0 top
TP18  33.02,36.2 0 top
TP19  36.2,36.2 0 top
TP20  39.37,36.2 0 top
U1  13.34,15.24 0 top
U2  24.13,8.89 0 top
U3  33.66,8.89 0 top
U4  43.81,8.89 0 top
U5  52.07,15.24 0 top
U6  42.55,27.94 0 top
U7  59.69,34.29 0 top
U8  38.73,19.68 90 top
U9  46.35,19.68 90 top
U10  50.16,36.2 270 top
U11  43.18,36.2 270 top
U12  57.15,21.59 90 top
U13  64.14,24.77 90 top
U14  62.87,43.18 270 top
U15  56.52,43.18 270 top
U$1  [UCB_CAL_350MIL]  17.78,33.66 0 top

### Tracks (layer width: path | path; a pad name or v marks a point on that pad's centre or on a via)
3V3  (via drill 0.6)
  Top 0.305: U1.14 11.04,15.49 10.79,15.24 v10.79,13.34
  Top 0.406: L1.P$2 15.24,10.16 | 15.24,10.16 16.51,11.43 R9.2 | R9.2 R23.2 C24.2 | R9.2 15.04,12.27 v14.61,12.7 | U8.1 40.16,17.67 R1.2 v41.91,17.14 | TP5.TESTPOINT 17.14,8.26 15.24,10.16
  Bottom 0.406: v14.61,12.7 11.43,12.7 v10.79,13.34
  Bottom 1.524: v14.61,12.7 37.47,12.7 v41.91,17.14
5V_1  (via drill 0.6)
  Top 0.305: v31.11,6.99 31.11,8.89 31.36,9.14 U3.14
  Top 0.406: R11.2 R20.2 C26.2 | R11.2 35.36,5.92 v34.92,6.35 | R11.2 36.83,5.08 35.56,3.81 L3.P$2 | U9.1 47.78,17.67 R2.2 48.26,17.14 48.9,17.78 v48.9,18.41
  Bottom 0.406: v34.92,6.35 31.75,6.35 v31.11,6.99 29.84,5.71 TP6.TESTPOINT
  Bottom 1.524: v34.92,6.35 36.2,6.35 48.26,18.41 v48.9,18.41
5V_2  (via drill 0.6)
  Top 0.305: v21.59,6.99 21.59,8.89 21.84,9.14 U2.14
  Top 0.406: R10.2 27.3,5.08 26.04,3.81 L2.P$2 | R10.2 R19.2 C25.2 | R10.2 25.83,5.92 v25.4,6.35 | U11.1 41.76,38.21 R4.2 42.28,41.01 43.81,42.55 45.72,42.55 v46.99,40.64 48.9,38.73 R3.2 | U10.1 48.74,38.21 R3.2 | R3.2 49.27,39 | TP7.TESTPOINT 20.32,5.71 v21.59,6.99
  Bottom 0.406: v25.4,6.35 22.23,6.35 v21.59,6.99
  Bottom 1.524: v25.4,6.35 29.84,10.79 38.1,10.79 44.45,17.14 44.45,38.1 v46.99,40.64
5V_3  (via drill 0.6)
  Top 0.305: v41.27,6.99 41.27,8.89 41.52,9.14 U4.14
  Top 0.406: C27.2 R21.2 R12.2 | L4.P$2 45.72,3.81 46.99,5.08 R12.2 | R12.2 45.52,5.92 v45.09,6.35 | U13.1 65.56,22.75 R6.2 64.77,21.96 64.77,20.95 62.87,19.05 R5.2 | v57.78,17.14 57.78,18.79 R5.2 | U12.1 58.58,19.57 R5.2
  Bottom 0.406: v45.09,6.35 41.91,6.35 v41.27,6.99 40.01,5.71 TP8.TESTPOINT
  Bottom 1.524: v45.09,6.35 50.16,6.35 57.15,13.34 57.15,16.51 v57.78,17.14
5V_4  (via drill 0.6)
  Top 0.305: v49.53,13.34 49.53,15.24 49.78,15.49 U5.14
  Top 0.406: R13.2 R22.2 C28.2 | R13.2 53.77,12.27 v53.34,12.7 | L5.P$2 53.98,10.16 55.24,11.43 R13.2 | U15.1 55.09,45.2 R8.2 v53.98,45.72 | U14.1 61.44,45.09 | 61.44,45.09 61.44,45.2 R7.2 | v60.33,45.72 60.8,45.72 61.44,45.09
  Bottom 0.406: TP9.TESTPOINT 52.7,23.5 54.61,21.59
  Bottom 1.524: v53.34,12.7 50.16,12.7 v49.53,13.34 49.53,16.51 54.61,21.59 60.33,21.59 62.23,23.5 62.23,44.3 60.8,45.72 v60.33,45.72 v53.98,45.72
!INT  (via drill 0.6)
  Top 0.254: J1.6 40.64,59.44 v40.64,48.9 | U7.17 57.78,40.64 57.15,41.27 54.61,41.27 51.82,44.07 40.89,44.07 v40.64,43.81 40.01,43.18 40.01,36.2 | U6.17 40.64,34.29 40.01,34.92 40.01,36.2 | TP20.TESTPOINT 40.01,36.2
  Bottom 0.254: v40.64,48.9 v40.64,43.81
GND  (via drill 0.2, 0.6)
  other vias: 41.91,19.05 60.33,26.04 53.98,50.16 12.83,15.75 13.84,15.75 13.34,15.24 12.83,14.73 13.84,14.73 24.13,8.89 23.62,9.4 24.64,9.4 23.62,8.38 24.64,8.38 33.66,8.89 33.15,9.4 34.16,9.4 34.16,8.38 33.15,8.38 43.81,8.89 43.31,8.38 44.32,8.38 44.32,9.4 43.31,9.4 52.07,15.24 51.56,15.75 52.58,15.75 52.58,14.73 51.56,14.73 53.34,44.45 59.69,44.2 53.34,41.27 42.55,43.18 46.99,37.47 23.5,45.72 35.56,40.64 33.66,26.67 59.69,34.29 23.5,21.59 12.7,6.99 52.7,6.35 62.23,20.32 23.5,33.02
  pour Top (rank 2): -1.27,67.31 68.58,67.31 68.58,-1.27 -1.27,-1.27
  pour Bottom (rank 2): -1.27,67.31 68.58,67.31 68.58,-1.27 -1.27,-1.27
N$1
  Top 0.305: C2.2 25.36,10.79 U2.9
N$2
  Top 0.305: U2.1 23.38,6.46 23.5,6.35 24.13,6.35 | U2.3 24.38,6.6 24.13,6.35 | U2.2 23.88,6.6 24.13,6.35
  Top 0.406: L2.P$1 22.78,5.87 23.38,6.46
N$3
  Top 0.305: U2.4 24.99,7.46 25.02,7.49
  Top 0.406: 25.02,7.49 26.59,7.49 R10.1
N$4
  Top 0.305: U2.5 27.85,8.14 | 27.85,8.14 R19.1 | R14.2 28.37,8.66 27.85,8.14
N$5
  Top 0.305: C3.2 34.88,10.79 U3.9
N$6
  Top 0.305: U3.1 32.91,6.46 33.02,6.35 33.66,6.35 | U3.2 33.41,6.6 33.66,6.35 | U3.3 33.91,6.6 33.66,6.35
  Top 0.406: L3.P$1 32.3,5.63 33.02,6.35
N$7
  Top 0.305: U3.4 34.45,7.46 34.54,7.37
  Top 0.406: 34.54,7.37 36.25,7.37 R11.1
N$8
  Top 0.305: C4.2 45.04,10.79 U4.9
N$9
  Top 0.305: U3.5 37.38,8.14 | 37.38,8.14 R20.1 | R15.2 37.9,8.66 37.38,8.14
N$10
  Top 0.305: U4.1 43.06,6.46 43.18,6.35 43.81,6.35 | U4.3 44.06,6.6 43.81,6.35 | U4.2 43.56,6.6 43.81,6.35
  Top 0.406: L4.P$1 42.47,5.63 43.18,6.35
N$11
  Top 0.305: U4.4 44.67,7.46 44.7,7.49
  Top 0.406: 44.7,7.49 46.28,7.49 R12.1
N$12
  Top 0.305: U4.5 47.54,8.14 | 47.54,8.14 R21.1 | R16.2 48.06,8.66 47.54,8.14
N$13
  Top 0.305: C5.2 53.3,17.14 U5.9
N$14
  Top 0.305: U5.1 51.32,12.81 51.44,12.7 52.07,12.7 | U5.3 52.32,12.95 52.07,12.7 | U5.2 51.82,12.95 52.07,12.7
  Top 0.406: L5.P$1 50.72,11.98 51.44,12.7
N$15
  Top 0.305: U5.4 52.93,13.81 52.96,13.84
  Top 0.406: 52.96,13.84 54.53,13.84 R13.1
N$16
  Top 0.305: U5.5 55.79,14.49 | 55.79,14.49 R22.1 | R17.2 56.31,15.01 55.79,14.49
N$20  (via drill 0.6)
  other vias: 4.45,45.72
N$21
  Top 0.254: U7.5 59.05,27.94 55.73,24.61 U12.4
N$22
  Top 0.254: U7.6 60.33,27.94 58.58,26.19 U12.3
N$23
  Top 0.254: U7.12 64.14,42.52 U14.4
N$24
  Top 0.254: U7.13 62.87,41.26 U14.3
N$25
  Top 0.254: U7.11 65.41,42.55 64.77,43.18 U14.5
N$26
  Top 0.254: U7.15 60.33,41.27 58.92,42.68 U15.4
N$27
  Top 0.254: U7.16 59.05,41.27 58.42,41.91 55.86,41.91 U15.3
N$28  (via drill 0.6)
  other vias: 4.45,33.66
N$29  (via drill 0.6)
  other vias: 4.45,21.59
N$30  (via drill 0.6)
  other vias: 53.98,56.52
N$43
  Top 0.254: U6.5 41.91,21.59 41.27,20.95 38.08,20.95 U8.4
N$46
  Top 0.254: U7.14 61.59,41.27 59.69,43.18 U15.5
N$47
  Top 0.254: U8.3 41.77,20.18 43.18,21.59 U6.6
N$48
  Top 0.254: U12.5 55.24,21.59 54.61,22.23 54.61,24.77 57.78,27.94 U7.4
N$49
  Top 0.254: U7.8 62.87,25.42 U13.4
N$50
  Top 0.254: U7.9 64.14,26.69 U13.3
N$51
  Top 0.254: U7.7 61.59,25.4 62.23,24.77 U13.5
N$52
  Top 0.254: U6.12 46.99,34.29 47.62,34.92 50.82,34.92 U10.4
N$53
  Top 0.254: U6.13 45.72,34.29 47.12,35.7 U10.3
N$54
  Top 0.254: U6.11 50.11,32.97 52.7,35.56 52.7,36.2 U10.5
N$55
  Top 0.254: U6.15 43.18,34.29 44.59,35.7 U11.4
N$56
  Top 0.254: U6.16 41.91,35.54 U11.3
N$57
  Top 0.254: U6.14 44.45,34.29 45.72,35.56 45.72,36.2 U11.5
N$61
  Top 0.305: C1.2 14.56,17.14 U1.9
N$62
  Top 0.305: 12.06,10.24 L1.P$1 | U1.3 13.59,12.95 13.34,12.7 | U1.2 13.09,12.95 13.34,12.7 | U1.1 12.59,12.81 12.7,12.7 13.34,12.7
  Top 0.406: 12.06,10.24 12.06,12.06 12.7,12.7
N$63
  Top 0.305: U1.4 14.19,13.81 14.22,13.84
  Top 0.406: 14.22,13.84 15.8,13.84 R9.1
N$64
  Top 0.305: U1.5 17.06,14.49 | 17.06,14.49 R23.1 | R18.2 17.58,15.01 17.06,14.49
N$67
  Top 0.254: U6.4 40.64,22.23 40.01,21.59 37.47,21.59 36.2,20.32 36.83,19.68 U8.5
N$68
  Top 0.254: U6.8 45.72,20.98 U9.4
N$70
  Top 0.254: U6.9 46.99,20.98 U9.3
N$71
  Top 0.254: U9.5 44.45,19.68 43.81,20.32 43.81,20.95 44.45,21.59 U6.7
SCL  (via drill 0.6)
  Top 0.254: J1.5 39.12,60.96 v39.12,48.26 | U7.18 56.52,37.47 48.9,29.84 40.64,29.84 39.37,31.11 U6.18 39.37,33.66 38.1,34.92 38.1,36.2 | 38.1,36.2 38.1,36.83 39.12,37.85 v39.12,43.81 | TP19.TESTPOINT 38.1,36.2
  Bottom 0.254: v39.12,43.81 v39.12,48.26
SDA  (via drill 0.6)
  Top 0.254: J1.3 41.66,60.96 v41.66,48.26 | v38.1,31.11 U6.19 | U7.19 55.24,37.47 48.9,31.11 v41.91,31.11
  Bottom 0.254: v41.66,48.26 41.66,31.37 v41.91,31.11 v38.1,31.11 TP18.TESTPOINT
VBATT
  Top 0.254: U2.13 22.7,9.75 22.73,9.78 | 23.38,11.31 23.38,11.4 23.35,11.43
  Top 0.305: U1.13 11.9,16.04 | 12.59,17.26 U1.12 12.59,17.66 12.7,17.78 | U1.11 13.09,17.53 13.34,17.78 13.59,17.53 U1.10 | U2.10 24.38,11.18 24.13,11.43 23.88,11.18 U2.11 | U2.12 23.38,11.31 23.5,11.43 | U3.10 33.91,11.18 33.66,11.43 33.41,11.18 U3.11 | U3.12 32.91,11.31 33.02,11.43 | U3.13 32.23,9.69 | U4.10 44.06,11.18 43.81,11.43 43.56,11.18 U4.11 | U4.12 43.06,11.31 43.18,11.43 | U4.13 42.38,9.69 | U5.10 52.32,17.53 52.07,17.78 51.82,17.53 U5.11 | U5.12 51.32,17.66 51.44,17.78 | U5.13 50.64,16.04
  Top 0.406: 33.66,11.43 33.02,11.43 32.88,11.43 C21.P$1 | 43.81,11.43 43.18,11.43 C22.P$1 | 51.44,17.78 52.07,17.78 | 50.64,16.04 50.64,16.51 | 50.64,16.51 50.64,17.62 50.8,17.78 51.2,17.78 51.32,17.66 | 50.64,16.51 48.9,16.51 47.75,15.37 C23.P$1 47.26,14.61 45.72,14.61 | 22.23,14.61 22.02,14.4 C7.1 22.59,13.02 C20.P$1 | 31.75,14.61 31.55,14.4 C8.1 32.37,12.51 C21.P$1 | C6.1 11.7,20.19 | 32.23,9.69 32.23,11.22 C21.P$1 | C22.P$1 42.17,12.87 C9.1 41.71,14.4 41.91,14.61 45.72,14.61 | 42.38,9.69 42.38,11.22 C22.P$1 | 22.73,9.78 22.73,12.05 C20.P$1 | 11.9,16.04 11.9,18.43 C19.P$1 | 13.34,17.78 12.7,17.78 12.56,17.78 C19.P$1 | C19.P$1 11.79,20.05 11.94,20.19 | 23.27,11.52 C20.P$1 | 24.13,11.43 23.35,11.43 C20.P$1 | C10.1 45.72,14.61
  Top 1.016: J1.17 25.15,63.75 24.77,64.14 19.68,64.14 17.78,62.23
  Top 1.27: 18.41,18.41 22.23,14.61 31.75,14.61 41.91,14.61 | 17.14,20.32 17.78,20.95 | 17.14,19.68 18.41,18.41 | 18.41,18.41 18.41,20.32 | 18.41,20.32 18.41,20.95 17.78,21.59 | 11.7,20.19 11.94,20.19 18.29,20.19 18.41,20.32
  Top 1.778: TP3.TESTPOINT 11.43,29.21
  Top 2.54: JP2.2 11.43,29.21 17.78,29.21
  Top 3.048: 17.78,62.23 17.78,29.21 17.78,21.59 17.78,20.95
  pour Top (isolate 0.127): 16.26,62.23 16.26,63.05 arc-71 16.68,63.65 19.56,64.64 19.68,63.37 19.3,62.23 16.51,62.23
  pour Top (no thermals): 12.06,20.83 11.64,20.83 arc37 11.26,20.7 10.92,20.45 10.92,19.94 11.26,19.68 arc37 11.64,19.56 12.06,19.56
  pour Top: 41.91,15.24 42.32,15.24 arc-39 42.72,15.1 43.18,14.73 43.18,14.48 42.72,14.11 arc-39 42.32,13.97 41.91,13.97
VCC_BACKPLANE  (via drill 0.6)
  Top 0.305: U8.6 34.99,19.18
  Top 0.406: U8.6 37.31,17.67 R1.1 | J1.13 31.5,60.96 31.5,57.78 30.86,57.15 | v53.34,31.11 53.98,30.48 U7.1 53.92,29.21 38.1,29.21 36.83,30.48 U6.20 30.91,32.97 30.86,33.02 | U7.20 53.98,38.1 v53.34,37.47 | C11.1 34.99,19.18 | TP11.TESTPOINT 30.86,45.72
  Top 1.524: 30.86,57.15 30.86,45.72 30.86,33.02 30.86,20.57 32.38,19.05 33.66,19.05
  Bottom 0.406: J1.2 45.72,59.69 46.99,60.96 46.99,63.5 46.35,64.14 32.13,64.14 J1.13 | v53.34,31.11 v53.34,37.47
  pour Top (no thermals): 33.66,19.81 34.1,19.81 arc-34 34.45,19.71 34.67,19.56 35.18,19.56 35.18,18.92 34.67,18.92 34.22,18.47 arc-45 33.77,18.29 33.66,18.29
  pour Top: 30.1,57.15 30.1,57.52 arc-45 30.28,57.97 31.37,59.05 31.62,59.05 31.62,57.15
VCC_LINUX
  Top 0.406: U9.6 44.93,17.67 | 44.93,17.67 R2.1 45.45,16.88 44.45,15.88 36.45,15.88 36.2,16.13 | 44.93,17.67 43.49,17.67 C12.1 | J1.4 44.2,60.96 44.2,63.12 43.18,64.14 29.84,64.14 28.96,63.25 28.96,57.53 28.57,57.15 | TP10.TESTPOINT 28.57,45.72
  Top 1.016: 28.57,16.51 28.96,16.26 28.96,16.13 36.2,16.13 36.32,16.13
  Top 1.524: 28.57,16.51 28.57,45.72 28.57,57.15
  pour Top: 36.2,16.64 36.6,16.64 arc-40 37.01,16.49 37.59,16 37.59,15.75 37.47,15.62 36.2,15.62
  pour Top: 27.81,57.15 27.81,57.52 arc-45 28,57.97 28.83,58.8 29.3,57.37 arc-18 29.34,57.17 29.34,57.15
VCC_MOD0  (via drill 0.6)
  Top 0.406: U10.6 51.59,38.21 R3.1 51.06,40.58 C13.1 50.8,40.64 | TP12.TESTPOINT 43.18,53.98
  Top 1.016: v46.35,43.18 46.99,43.18 49.53,40.64 50.8,40.64 | v46.35,48.26 45.09,48.26 43.18,50.16 43.18,53.98 v43.18,57.15
  Bottom 0.406: J1.7 39.12,60.96 41.15,60.96 41.66,60.45 41.66,58.67 v43.18,57.15
  Bottom 1.016: v46.35,48.26 v46.35,43.18
VCC_MOD1  (via drill 0.6)
  Top 0.406: U11.6 44.6,38.1 | 44.6,38.1 44.6,38.21 R4.1 43.94,38.87 43.94,40.77 v44.45,41.27 | C14.1 45.24,38.73 44.6,38.1 | J1.8 v37.85,53.34 37.85,50.55 TP13.TESTPOINT
  Bottom 1.016: v37.85,53.34 41.27,53.34 44.45,50.16 v44.45,41.27
VCC_MOD2  (via drill 0.6)
  Top 0.406: R5.1 55.73,19.57 U12.6 53.41,21.09 C15.1 52.5,21.16 v49.53,24.13 | J1.9 36.58,60.96 v36.58,56.9 36.58,53.72 TP14.TESTPOINT
  Bottom 0.406: v36.58,56.9 36.58,56.77
  Bottom 1.016: v49.53,24.13 49.53,46.99 41.27,55.24 38.1,55.24 36.58,56.77
VCC_MOD5  (via drill 0.6)
  Top 0.406: U13.6 62.71,22.75 R6.1 62.43,22.23 61.16,23.5 | 61.16,23.5 C16.1 | v59.69,23.5 61.16,23.5
  Bottom 0.406: J1.10 35.56,59.69 | TP15.TESTPOINT 50.16,51.44 48.58,49.85
  Bottom 1.016: v59.69,23.5 58.42,23.5 50.8,31.11 50.8,47.62 48.58,49.85 41.27,57.15 38.1,57.15 35.56,59.69
VCC_MOD6
  Top 0.406: U14.6 64.29,45.2 R7.1 | R7.1 C17.1 | J1.11 34.04,60.96 34.04,57.4 34.29,57.15 | R7.1 63.77,46.09 | TP16.TESTPOINT 56.52,48.9
  Top 1.016: 34.29,57.15 34.29,50.8 38.73,46.35 50.8,46.35 53.34,48.9 56.52,48.9 59.69,48.9 61.59,46.99 62.23,46.99
  pour Top (no thermals): 62.23,47.5 62.62,47.5 arc-42 63.05,47.33 64.14,46.35 64.14,45.09 63.37,45.09 63.37,45.97 63.37,46.1 63.18,46.3 arc45 62.73,46.48 61.98,46.48 61.98,47.5
  pour Top: 33.78,57.15 33.78,57.72 arc-11 33.79,57.85 33.91,58.42 34.16,58.42 34.74,57.39 arc-29 34.8,57.15
VCC_MOD7
  Top 0.406: U15.6 57.94,45.2 R8.1 | R8.1 57.41,46.09 | C18.1 58.48,46.79 R8.1 | TP17.TESTPOINT 36.83,43.81 38.1,45.09
  Top 1.016: J1.12 32.77,50.42 38.1,45.09 51.44,45.09 53.98,47.62 56.52,47.62 57.41,46.73 57.41,46.09
VSOL+
  Bottom 0.406: JP1.2 6.35,42.55
  Bottom 1.778: TP1.TESTPOINT 11.43,47.62
  Bottom 3.048: 19.68,61.59 17.78,59.69 17.78,53.98 11.43,47.62 6.35,42.55
  pour Bottom (no thermals): 7.11,41.27 5.08,43.31 3.81,41.27 3.81,40.01 5.08,40.01
  pour Bottom (no thermals): 22.61,62.99 19.68,63.12 19.68,60.33 20.57,60.33 22.61,61.47
VSOL-
  Bottom 0.406: JP1.1 7.62,38.73
  Bottom 1.778: TP2.TESTPOINT 11.43,40.64
  Bottom 3.048: 22.61,57.15 22.61,49.91 13.34,40.64 11.43,40.64 9.53,40.64 7.62,38.73
  pour Bottom (no thermals): 4.45,38.99 6.73,40.01 8.26,37.34 7.75,37.21 4.45,37.21 3.81,37.47 3.81,38.73
  pour Bottom (no thermals): 21.08,57.15 21.55,59.5 arc-34 21.73,59.83 22.35,60.45 22.86,60.45 23.4,59.8 arc-26 23.53,59.55 24.13,57.15

### Text on the board
tSilk: VSOL+ | VSOL- | VBATT+ | Signpost Power Module / Rev A / N. Jackson / 9/2/2016 | VBATT-